# EAGLE board smoothieboard (EAGLE 6.2), part 1 of 3
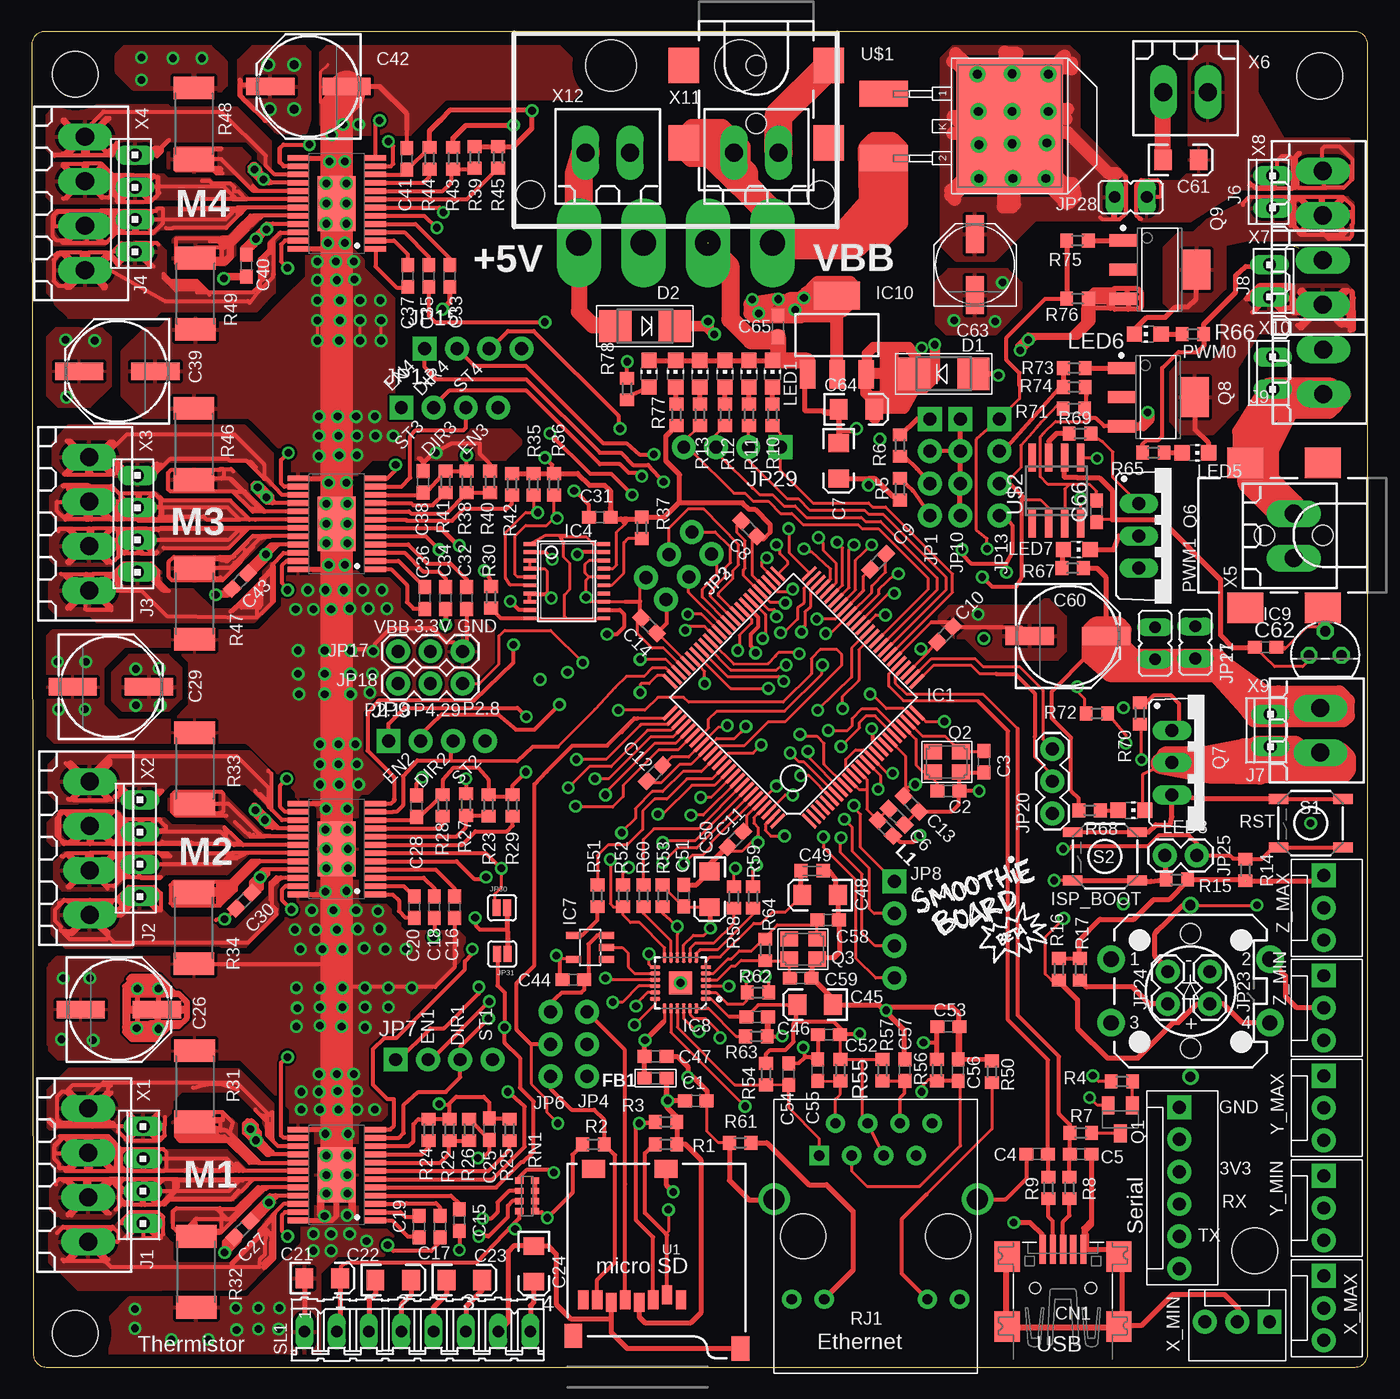
[diagram p3: board, top side]
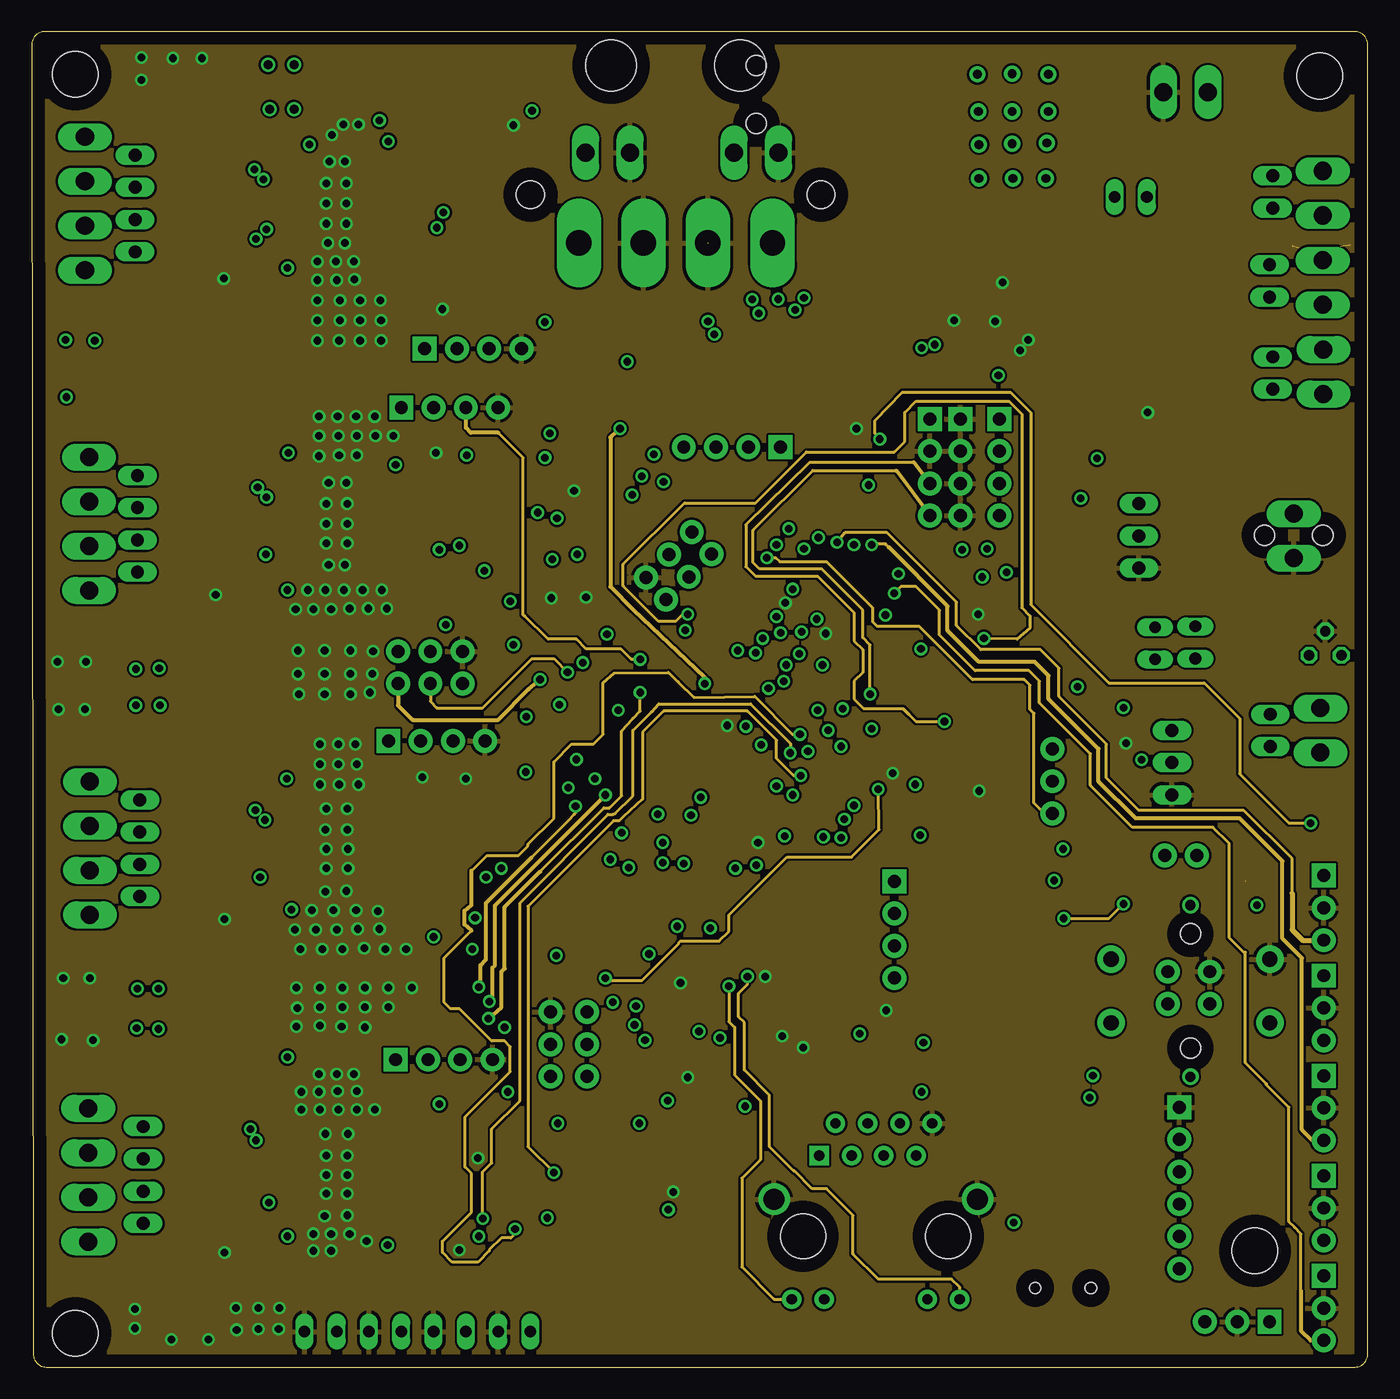
[diagram p4: board, inner layer Route2]
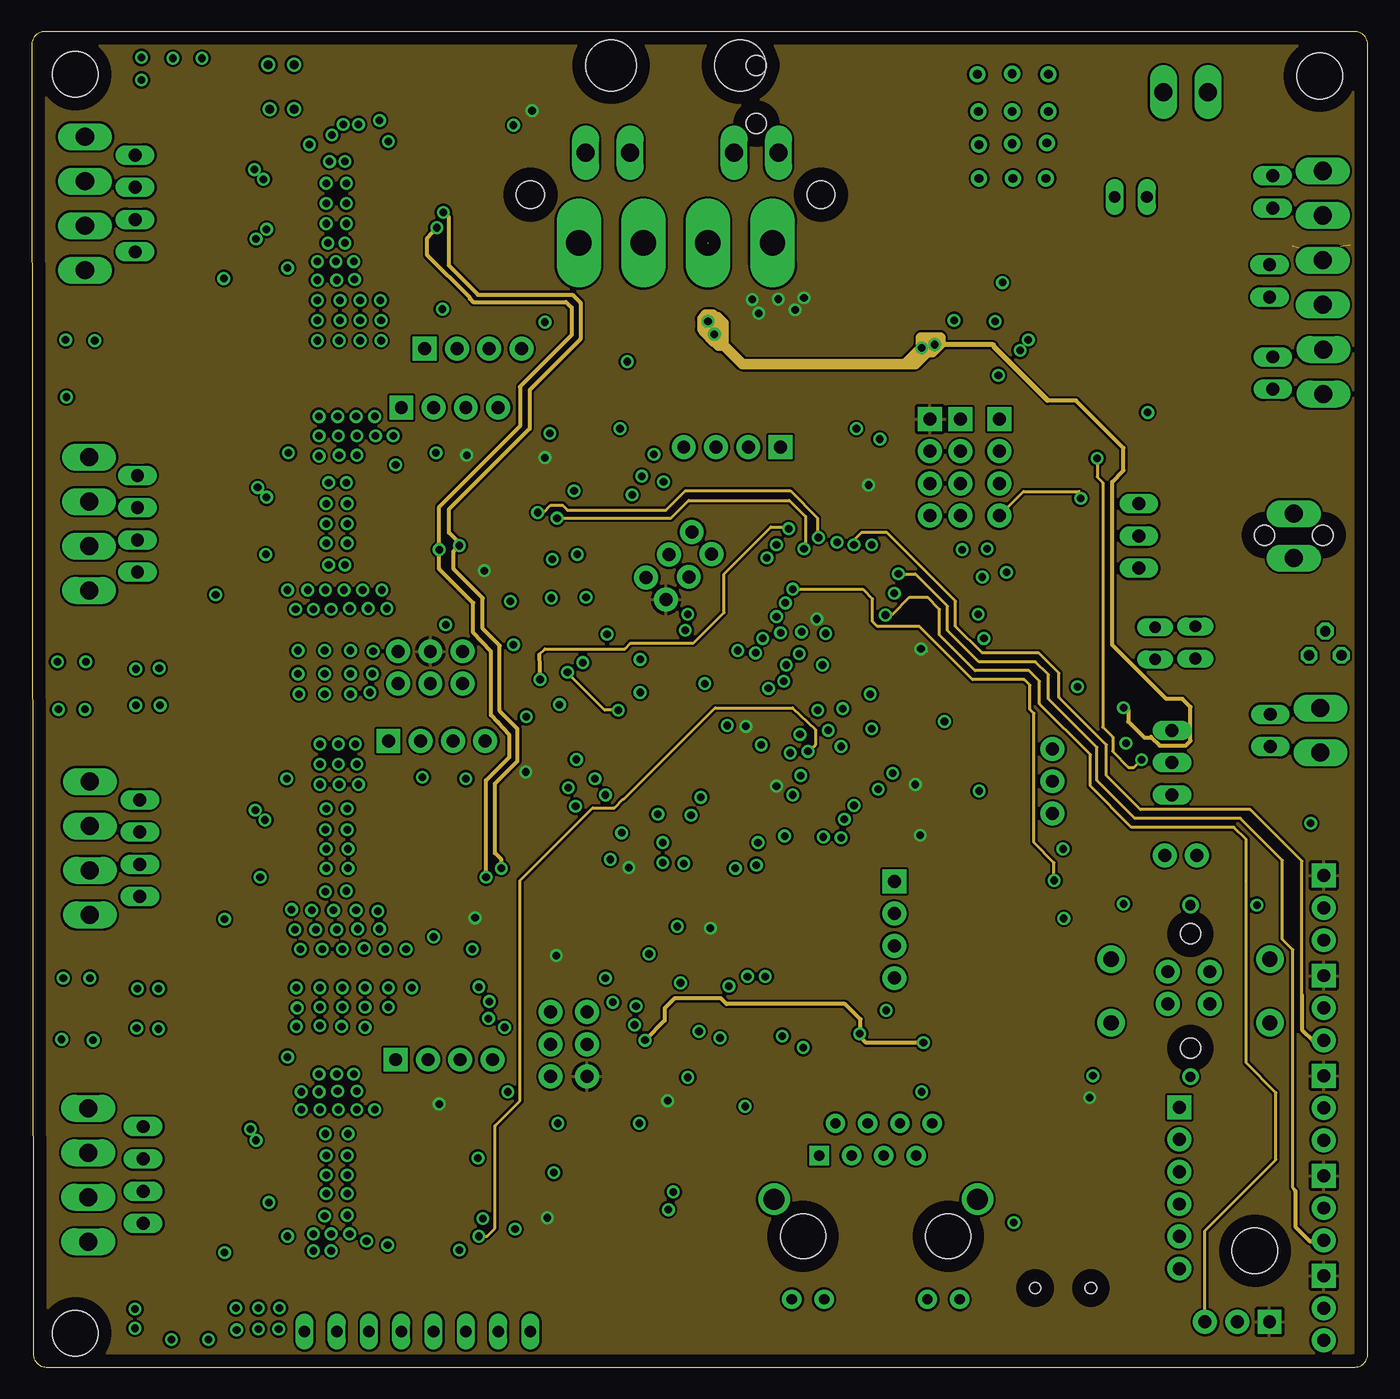
[diagram p5: board, inner layer Route15]
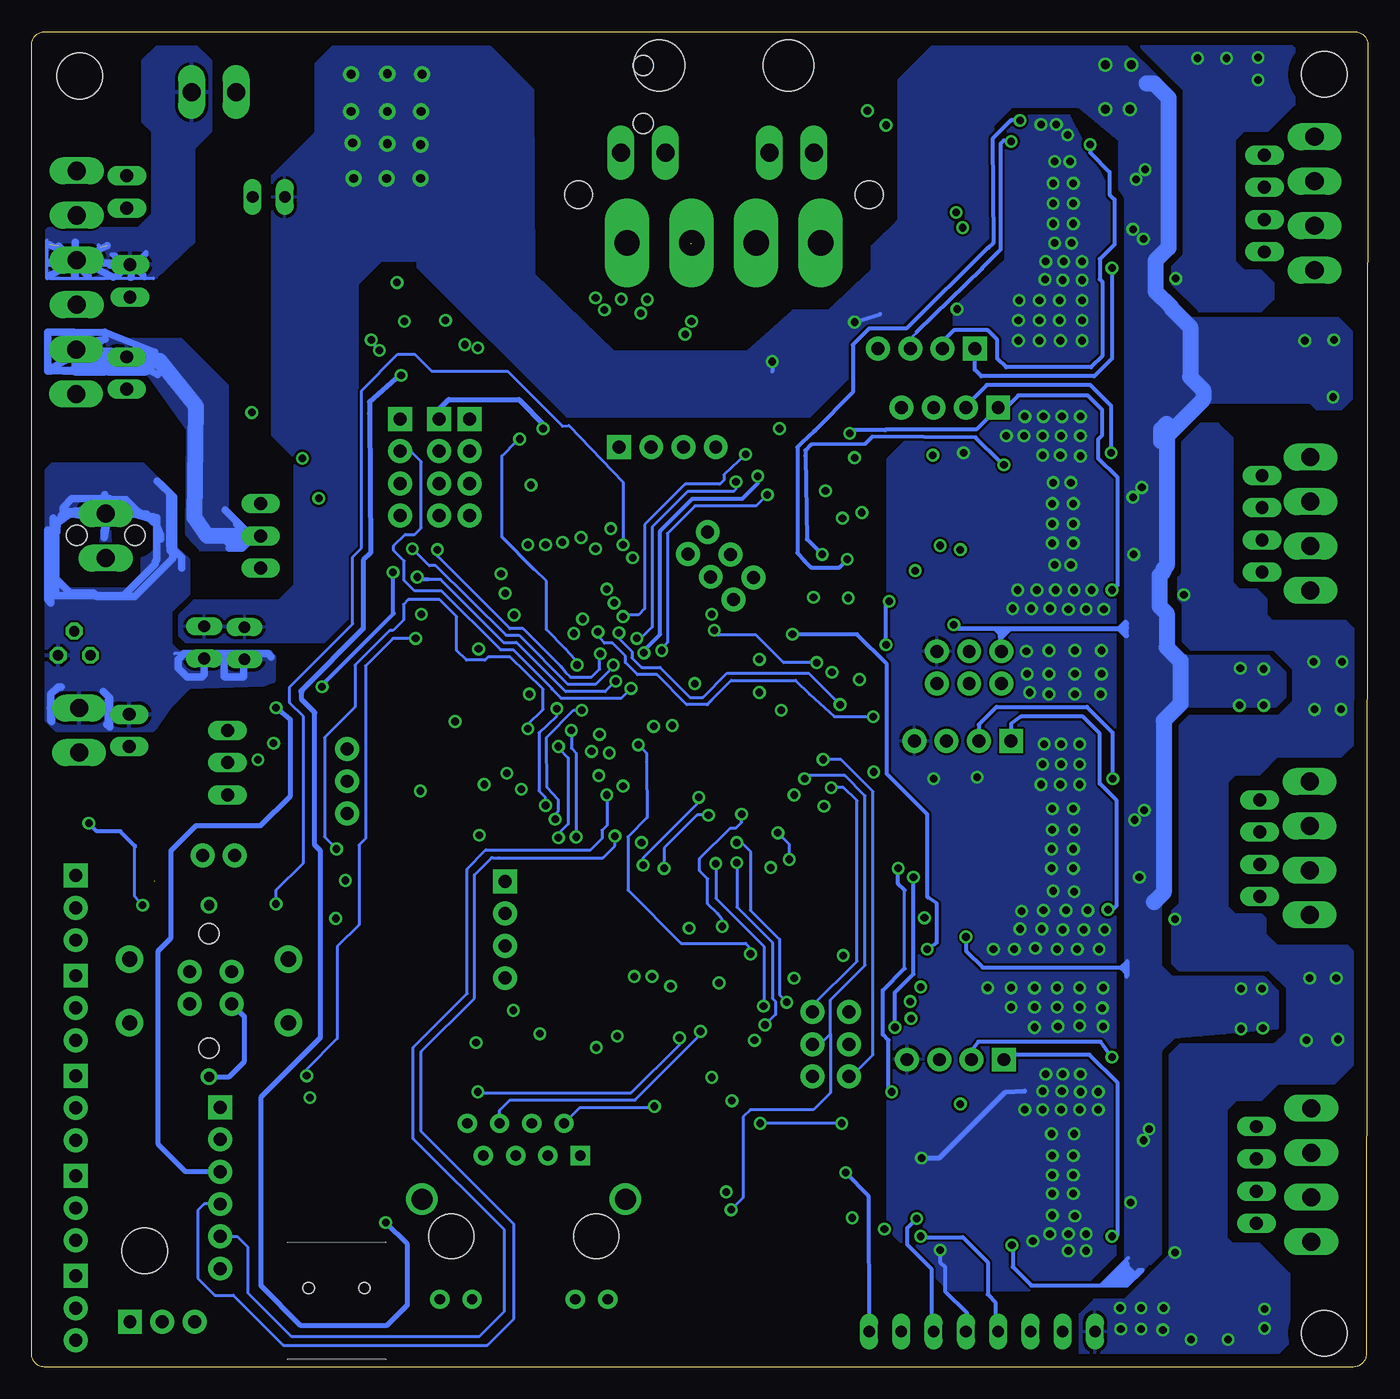
[diagram p6: board, bottom side, seen from below]

Size 105.13 x 105.08 mm. Coordinates in mm from the lower left corner, seen from the top.
Outline: 0,104.08 0.12,1 arc90 1.12,0 104.13,0 arc90 105.13,1 105.13,104.08 arc90 104.13,105.08 1,105.08 arc90 0,104.08
Copper layers (1*2+15*16): Top 0.035mm / dielectric 0.5mm / Route2 0.035mm / dielectric 0.5mm / Route15 0.035mm / dielectric 0.5mm / Bottom 0.035mm
Design rules: minimum track width 10mil, minimum drill 12mil, track to track 7mil, track to pad 7mil, pad to pad 7mil, via to via 7mil, smd to smd 7mil, copper to edge 40mil, drill to drill 8mil, minimum pad ring 10mil, minimum via ring 8mil, stop-mask expansion 4mil, vias tented up to drill 0mil, thermal gap 10mil
Holes 3.6 mm at 3.43,101.73 3.43,2.67 96.26,9.14 101.34,101.6

## Footprints (pad centres in the part's own frame; a part is rotated, then mirrored left to right if it is on the bottom)
C0603 = smd 1.1 x 1: 1 -0.85,0; 2 0.85,0
EIA3216 = smd 1.4 x 1.6: A 1.4,0; C -1.4,0
PANASONIC_E = smd 3.8 x 1.4: + 3,0; - -3,0
C0603K = smd 1.05 x 1.08: 1 -0.875,0; 2 0.875,0
PANASONIC_D = smd 3 x 1.4: + 2.4,0; - -2.4,0
USB-MINIB = smd 0.5 x 2.308: D+ 0,4.064; D- -0.8,4.064; GND 1.6,4.064; ID 0.8,4.064; VBUS -1.6,4.064 | smd 2 x 2.4: GND1 -4.4,-2; GND2 -4.4,3.5; GND3 4.4,3.5; GND4 4.4,-2 | hole 0.9: -2.2,1; 2.2,1
SMADIODE = smd 2.54 x 2.54: A 2.349,0; C -2.349,0
0603 = smd 1.1 x 1: 1 -0.85,0; 2 0.85,0
LQFP100 = smd 0.27 x 1.5: 1 -6,-7.75; 2 -5.5,-7.75; 3 -5,-7.75; 4 -4.5,-7.75; 5 -4,-7.75; 6 -3.5,-7.75; 7 -3,-7.75; 8 -2.5,-7.75; 9 -2,-7.75; 10 -1.5,-7.75; 11 -1,-7.75; 12 -0.5,-7.75; 13 0,-7.75; 14 0.5,-7.75; 15 1,-7.75; 16 1.5,-7.75; 17 2,-7.75; 18 2.5,-7.75; 19 3,-7.75; 20 3.5,-7.75; 21 4,-7.75; 22 4.5,-7.75; 23 5,-7.75; 24 5.5,-7.75; 25 6,-7.75; 51 6,7.75; 52 5.5,7.75; 53 5,7.75; 54 4.5,7.75; 55 4,7.75; 56 3.5,7.75; 57 3,7.75; 58 2.5,7.75; 59 2,7.75; 60 1.5,7.75; 61 1,7.75; 62 0.5,7.75; 63 0,7.75; 64 -0.5,7.75; 65 -1,7.75; 66 -1.5,7.75; 67 -2,7.75; 68 -2.5,7.75; 69 -3,7.75; 70 -3.5,7.75; 71 -4,7.75; 72 -4.5,7.75; 73 -5,7.75; 74 -5.5,7.75; 75 -6,7.75 | smd 1.5 x 0.27: 26 7.75,-6; 27 7.75,-5.5; 28 7.75,-5; 29 7.75,-4.5; 30 7.75,-4; 31 7.75,-3.5; 32 7.75,-3; 33 7.75,-2.5; 34 7.75,-2; 35 7.75,-1.5; 36 7.75,-1; 37 7.75,-0.5; 38 7.75,0; 39 7.75,0.5; 40 7.75,1; 41 7.75,1.5; 42 7.75,2; 43 7.75,2.5; 44 7.75,3; 45 7.75,3.5; 46 7.75,4; 47 7.75,4.5; 48 7.75,5; 49 7.75,5.5; 50 7.75,6; 76 -7.75,6; 77 -7.75,5.5; 78 -7.75,5; 79 -7.75,4.5; 80 -7.75,4; 81 -7.75,3.5; 82 -7.75,3; 83 -7.75,2.5; 84 -7.75,2; 85 -7.75,1.5; 86 -7.75,1; 87 -7.75,0.5; 88 -7.75,0; 89 -7.75,-0.5; 90 -7.75,-1; 91 -7.75,-1.5; 92 -7.75,-2; 93 -7.75,-2.5; 94 -7.75,-3; 95 -7.75,-3.5; 96 -7.75,-4; 97 -7.75,-4.5; 98 -7.75,-5; 99 -7.75,-5.5; 100 -7.75,-6
ETSSOP24 = smd 4.32 x 3: EPAD 0,0 | smd 0.45 x 1.65: P01 -3.575,-3.05; P02 -2.925,-3.05; P03 -2.275,-3.05; P04 -1.625,-3.05; P05 -0.975,-3.05; P06 -0.325,-3.05; P07 0.325,-3.05; P08 0.975,-3.05; P09 1.625,-3.05; P10 2.275,-3.05; P11 2.925,-3.05; P12 3.575,-3.05; P13 3.575,3.05; P14 2.925,3.05; P15 2.275,3.05; P16 1.625,3.05; P17 0.975,3.05; P18 0.325,3.05; P19 -0.325,3.05; P20 -0.975,3.05; P21 -1.625,3.05; P22 -2.275,3.05; P23 -2.925,3.05; P24 -3.575,3.05
TSSOP20 = smd 0.305 x 0.991: 1 -2.925,-2.918; 2 -2.275,-2.918; 3 -1.625,-2.918; 4 -0.975,-2.918; 5 -0.325,-2.918; 6 0.325,-2.918; 7 0.975,-2.918; 8 1.625,-2.918; 9 2.275,-2.918; 10 2.925,-2.918; 11 2.925,2.918; 12 2.275,2.918; 13 1.625,2.918; 14 0.975,2.918; 15 0.325,2.918; 16 -0.325,2.918; 17 -0.975,2.918; 18 -1.625,2.918; 19 -2.275,2.918; 20 -2.925,2.918
SOT23-5 = smd 0.55 x 1.2: 1 -0.95,-1.3; 2 0,-1.3; 3 0.95,-1.3; 4 0.95,1.3; 5 -0.95,1.3
QFN24_4MM = smd 0.8 x 0.28: 1 -2,1.25; 2 -2,0.75; 3 -2,0.25; 4 -2,-0.25; 5 -2,-0.75; 6 -2,-1.25; 13 2,-1.25; 14 2,-0.75; 15 2,-0.25; 16 2,0.25; 17 2,0.75; 18 2,1.25 | smd 0.28 x 0.8: 7 -1.25,-2; 8 -0.75,-2; 9 -0.25,-2; 10 0.25,-2; 11 0.75,-2; 12 1.25,-2; 19 1.25,2; 20 0.75,2; 21 0.25,2; 22 -0.25,2; 23 -0.75,2; 24 -1.25,2 | smd 1.778 x 1.778: THERM 0,0
TO92 = drill 0.813 octagon: 1 -1.27,0; 2 0,1.905; 3 1.27,0
SOT223 = smd 1.219 x 2.235: 1 -2.311,-3.099; 2 0,-3.099; 3 2.311,-3.099 | smd 3.6 x 2.2: 4 0,3.099
10X04MTA = drill 1.016 long: 1 3.81,0; 2 1.27,0; 3 -1.27,0; 4 -3.81,0
POWER_JACK_SMD = smd 2.8 x 2.4: GND 0,-5.7; P$4 6.1,-5.7; VIN0 0,5.7; VIN1 6.1,5.7 | hole 1.6: 0,0; 4.572,0
10X02MTA = drill 1.016 long: 1 1.27,0; 2 -1.27,0
1X04_NO_SILK = drill 1.016 pad 1.88 square: 1 0,0 | drill 1.016 pad 1.88: 2 2.54,0; 3 5.08,0; 4 7.62,0
1X03_NO_SILK = drill 1.016 pad 1.88: 1 0,0; 2 2.54,0; 3 5.08,0
MOLEX-1X6 = drill 1.016 pad 1.88 square: 1 0,0 | drill 1.016 pad 1.88: 2 2.54,0; 3 5.08,0; 4 7.62,0; 5 10.16,0; 6 12.7,0
JP1 = drill 0.914 long: 1 0,-1.27; 2 0,1.27
MOLEX-1X3 = drill 1.016 pad 1.88 square: 1 0,0 | drill 1.016 pad 1.88: 2 2.54,0; 3 5.08,0
1X03 = drill 1.016 pad 1.88: 1 0,0; 2 2.54,0; 3 5.08,0
1X02 = drill 1.016 pad 1.88: 1 0,0; 2 2.54,0
SJ_2S = smd 0.635 x 1.27: 1 -0.412,0; 2 0.412,0
CHIP-LED0805 = smd 1.2 x 1.2: A 0,-1.05; C 0,1.05
MOLEX8981 = drill 2 pad 3.5 long: P$1 -1.27,2.54; P$2 -1.27,7.62; P$3 -1.27,12.7; P$4 -1.27,17.78 | hole 2.2: 2.54,21.59; 2.54,-1.27 | hole 4: 12.7,5.08; 12.7,15.24
SOT23-BEC = smd 1 x 1.4: B -0.95,-1.1; C 0,1.1; E 0.95,-1.1
CRYSTAL_3.2X2.5 = smd 1.4 x 1.2: 1 -1.1,-0.8; 2 1.1,0.8; GND1 -1.1,0.8; GND2 1.1,-0.8
TO220BV = drill 1.016 long: D 0,-2.54; G -2.54,-2.54; S 2.54,-2.54
SOT230P700X160-4N = smd 2.15 x 0.95: 1 -2.9,2.3; 2 -2.9,0; 3 -2.9,-2.3 | smd 2.15 x 3.15: 4 2.9,0
R0603 = smd 1 x 1.1: 1 -0.85,0; 2 0.85,0
R2512 = smd 1.8 x 3.2: 1 -2.8,0; 2 2.8,0
HR911105A = drill 0.813 pad 1.524: G+ 4.953,-6.604; G- 4.953,-4.064; GND -8.89,4.445; NC -6.35,3.175; P4 -8.89,-0.635; P5 -6.35,0.635; RD+ -6.35,-1.905; RD- -8.89,1.905; TD- -8.89,-3.175; Y+ 4.953,6.604; Y- 4.953,4.064 | drill 1.651 pad 2.159: SHIELD0 -2.921,8.001; SHIELD1 -2.921,-8.001 | drill 0.813 pad 1.524 square: TD+ -6.35,-4.445 | hole 3.556: 0,-5.715; 0,5.715
0603-ARV = smd 0.5 x 0.65: 1 -1.2,-0.625; 2 -0.4,-0.625; 3 0.4,-0.625; 4 1.2,-0.625; 5 1.2,0.625; 6 0.4,0.625; 7 -0.4,0.625; 8 -1.2,0.625
TACTILE_SWITCH_SMD = smd 1.524 x 0.762: 1 -2.54,1.905; 2 2.54,1.905; 3 -2.54,-1.905; 4 2.54,-1.905
TACTILE-PTH-LED-12MM = drill 1.2 pad 2.159: 1 -6.25,2.5; 2 6.25,2.5; 3 -6.25,-2.5; 4 6.25,-2.5 | drill 0.8: A 0,6.75; C 0,-6.75 | hole 1.6: 0,4.5; 0,-4.5
08P = drill 0.914 long: 1 -8.89,0; 2 -6.35,0; 3 -3.81,0; 4 -1.27,0; 5 1.27,0; 6 3.81,0; 7 6.35,0; 8 8.89,0
MICRO-SD-SOCKET-PP = smd 0.8 x 1.5: 1 -8.94,10.7; 2 -7.84,10.3; 3 -6.74,10.7; 4 -5.64,10.9; 5 -4.54,10.7; 6 -3.44,10.9; 7 -2.34,10.7; 8 -1.24,10.7 | smd 1.8 x 1.4: CD1 -2.05,0.4; CD2 -7.75,0.4 | smd 1.4 x 1.9: GND1 -13.6,14.55; GND3 -0.45,13.55
TO263AB = smd 2.032 x 3.81: 1 3.81,2.54; 2 8.89,2.54 | smd 10.668 x 8.382: K 6.35,12.446
SOIC8 = smd 0.6 x 2.2: 1 -1.905,-2.6; 2 -0.635,-2.6; 3 0.635,-2.6; 4 1.905,-2.6; 5 1.905,2.6; 6 0.635,2.6; 7 -0.635,2.6; 8 -1.905,2.6
180G-4 = drill 1.422 long: 1 -5.25,0; 2 -1.75,0; 3 1.75,0; 4 5.25,0
180G-2 = drill 1.422 long: 1 -1.75,0; 2 1.75,0

## Placement (x,y rotation side)
C1  .1uF  [C0603]  52.26,20.95 180 top
C2  12pF  [C0603]  72.13,45.34 0 top
C3  12pF  [C0603]  74.93,47.62 270 top
C4  18pF  [C0603]  79.12,16.76 0 top
C5  18pF  [C0603]  82.55,16.76 180 top
C6  .1uF  [C0603]  68.07,43.31 315 top
C7  10uF  [EIA3216]  63.5,71.31 270 top
C8  .1uF  [C0603]  56.45,65.98 315 top
C9  .1uF  [C0603]  66.61,63.37 225 top
C10  .1uF  [C0603]  71.88,57.66 225 top
C11  .1uF  [C0603]  55.37,41.53 45 top
C12  .1uF  [C0603]  49.02,46.74 225 top
C13  .1uF  [C0603]  69.21,44.32 135 top
C14  .1uF  [C0603]  48.58,58.36 315 top
C15  .22uF  [C0603]  33.65,11.56 90 top
C16  .22uF  [C0603]  33.27,36.2 90 top
C17  .1uF  [C0603]  32.13,11.05 90 top
C18  .1uF  [C0603]  31.69,36.2 90 top
C19  .1uF  [C0603]  30.48,11.05 270 top
C20  .1uF  [C0603]  30.1,36.2 270 top
C21  10uF  [EIA3216]  22.86,6.99 0 top
C22  10uF  [EIA3216]  28.45,6.86 0 top
C23  10uF  [EIA3216]  34.03,6.86 0 top
C24  10uF  [EIA3216]  39.5,8.13 270 top
C25  .1uF  [C0603]  36,18.73 270 top
C26  100uF  [PANASONIC_E]  6.86,28.13 0 top
C27  .1uF  [C0603]  16.57,10.86 225 top
C28  .1uF  [C0603]  30.29,44.13 90 top
C29  100uF  [PANASONIC_E]  6.22,53.53 0 top
C30  .1uF  [C0603]  16.7,36.7 225 top
C31  .1uF  [C0603]  44.7,66.87 0 top
C32  .22uF  [C0603]  34.23,60.52 90 top
C33  .22uF  [C0603]  32.89,85.85 90 top
C34  .1uF  [C0603]  32.57,60.52 90 top
C35  .1uF  [C0603]  31.24,85.85 90 top
C36  .1uF  [C0603]  30.92,60.52 270 top
C37  .1uF  [C0603]  29.59,85.85 270 top
C38  .1uF  [C0603]  30.8,69.66 90 top
C39  100uF  [PANASONIC_E]  6.73,78.36 180 top
C40  .1uF  [C0603]  16.89,86.68 270 top
C41  .1uF  [C0603]  29.53,95.06 90 top
C42  100uF  [PANASONIC_E]  21.78,100.77 180 top
C43  .1uF  [C0603]  16.38,61.85 225 top
C44  .1uF  [C0603]  42.61,30.48 0 top
C45  10uF  [EIA3216]  61.66,28.51 180 top
C46  .1uF  [C0603]  57.09,27.56 0 top
C47  .1uF  [C0603]  49.08,24.45 0 top
C48  1uF  [EIA3216]  62.04,37.15 180 top
C49  470pF  [C0603K]  61.4,39.05 0 top
C50  10uF  [EIA3216]  53.34,37.59 270 top
C51  .1uF  [C0603]  51.31,37.08 90 top
C52  .1uF  [C0603]  62.74,26.16 180 top
C53  .1uF  [C0603]  72.13,26.8 0 top
C54  18pF  [C0603]  59.56,23.05 90 top
C55  18pF  [C0603]  61.85,23.37 90 top
C56  18pF  [C0603]  72.9,23.37 90 top
C57  18pF  [C0603]  68.71,23.37 90 top
C58  12pF  [C0603]  62.67,35.18 0 top
C59  12pF  [C0603]  60.51,30.61 0 top
C60  100uF  [PANASONIC_E]  81.53,57.53 0 top
C61  10uF  [EIA3216]  90.42,95 0 top
C62  .1uF  [C0603]  97.09,56.64 0 top
C63  100uF  [PANASONIC_D]  74.23,86.74 90 top
C64  10uF  [EIA3216]  64.9,75.37 0 top
C65  .1uF  [C0603]  58.72,81.91 270 top
C66  .1uF  [C0603]  83.79,67.35 90 top
CN1  [USB-MINIB]  81.15,5.21 0 top
D1  MBRA210LT3  [SMADIODE]  71.75,78.17 0 top
D2  MBRA210LT3  [SMADIODE]  48.26,81.92 180 top
FB1  [0603]  49.08,22.73 180 top
IC1  [LQFP100]  59.94,52.7 45 top
IC2  A4982  [ETSSOP24]  24,15.11 90 top
IC3  A4982  [ETSSOP24]  24,40.77 90 top
IC4  MCP44X1  [TSSOP20]  42.1,61.85 270 top
IC5  A4982  [ETSSOP24]  24,66.36 90 top
IC6  A4982  [ETSSOP24]  24,91.57 90 top
IC7  [SOT23-5]  43.94,33.02 90 top
IC8  [QFN24_4MM]  51.05,30.23 180 top
IC9  78L12Z  [TO92]  101.79,56.01 0 top
IC10  LM1117-3.3V  [SOT223]  63.37,81.22 0 top
J1  [10X04MTA]  8.76,15.11 90 top
J2  [10X04MTA]  8.51,40.83 90 top
J3  [10X04MTA]  8.32,66.36 90 top
J4  [10X04MTA]  8.13,91.57 90 top
J5  POWER_JACKSMD  [POWER_JACK_SMD]  101.6,65.47 180 top
J6  [10X02MTA]  97.65,92.48 90 top
J7  [10X02MTA]  97.47,50.1 90 top
J8  [10X02MTA]  97.41,85.47 270 top
J9  [10X02MTA]  97.66,78.22 90 top
J10  POWER_JACKSMD  [POWER_JACK_SMD]  57.02,102.43 270 top
JP1  [1X04_NO_SILK]  70.67,74.61 270 top
JP2  [1X03_NO_SILK]  49.91,60.39 45 top
JP3  [1X03_NO_SILK]  51.94,65.72 225 top
JP4  [1X03_NO_SILK]  43.69,22.86 90 top
JP5  [MOLEX-1X6]  90.3,20.45 270 top
JP6  [1X03_NO_SILK]  40.83,22.86 90 top
JP7  [1X04_NO_SILK]  28.64,24.19 0 top
JP8  [1X04_NO_SILK]  67.88,38.23 270 top
JP9  [1X04_NO_SILK]  28.07,49.28 0 top
JP10  [1X04_NO_SILK]  73.09,74.61 270 top
JP11  [JP1]  91.57,57.02 0 top
JP12  [1X04_NO_SILK]  29.08,75.5 0 top
JP13  [1X04_NO_SILK]  76.14,74.61 270 top
JP14  [MOLEX-1X3]  101.66,7.18 270 top
JP15  [1X04_NO_SILK]  30.92,80.14 0 top
JP16  [MOLEX-1X3]  101.66,15.05 270 top
JP17  [1X03]  28.83,56.32 0 top
JP18  [1X03]  33.91,53.78 180 top
JP19  [MOLEX-1X3]  101.66,22.92 270 top
JP20  [1X03]  80.33,48.64 270 top
JP21  [MOLEX-1X3]  101.66,30.8 270 top
JP22  [MOLEX-1X3]  101.66,38.67 270 top
JP23  [1X02]  92.71,28.57 90 top
JP24  [1X02]  89.41,28.57 90 top
JP25  [1X02]  91.69,40.26 180 top
JP26  [MOLEX-1X3]  97.41,3.56 180 top
JP27  [JP1]  88.39,56.96 0 top
JP28  [JP1]  86.49,92.08 90 top
JP29  [1X04_NO_SILK]  58.93,72.39 180 top
JP30  [SJ_2S]  37.01,36.14 0 top
JP31  [SJ_2S]  37.02,32.5 180 top
L1  [0603]  67.18,42.42 315 top
LED1  [CHIP-LED0805]  58.29,78.17 0 top
LED2  [CHIP-LED0805]  56.45,78.17 0 top
LED3  [CHIP-LED0805]  54.55,78.17 0 top
LED4  [CHIP-LED0805]  52.58,78.17 0 top
LED5  [CHIP-LED0805]  91.57,71.95 270 top
LED6  [CHIP-LED0805]  87.82,81.28 90 top
LED7  [CHIP-LED0805]  82.23,64.33 270 top
LED8  [CHIP-LED0805]  86.55,43.81 270 top
LED9  [CHIP-LED0805]  50.67,78.17 0 top
LED10  [CHIP-LED0805]  48.58,78.17 0 top
POWER  POWER  [MOLEX8981]  60.83,89.73 90 top
Q1  BC857ALT1SMD  [SOT23-BEC]  85.66,19.49 180 top
Q2  12MHz  [CRYSTAL_3.2X2.5]  72.01,47.62 180 top
Q3  25MHz  [CRYSTAL_3.2X2.5]  60.7,32.89 0 top
Q6  IRF540  [TO220BV]  89.66,65.41 270 top
Q7  IRF540  [TO220BV]  92.26,47.56 270 top
Q8  BSP100  [SOT230P700X160-4N]  88.64,76.33 0 top
Q9  BSP100  [SOT230P700X160-4N]  88.77,86.36 0 top
R1  10K  [R0603]  49.91,17.53 0 top
R2  10K  [R0603]  44.19,17.53 180 top
R3  10K  [R0603]  49.91,19.3 0 top
R4  470R  [R0603]  85.79,22.48 180 top
R5  10K  [R0603]  68.33,69.08 270 top
R6  10K  [R0603]  68.32,72.52 90 top
R7  1.5K  [R0603]  82.55,18.41 0 top
R8  33R  [R0603]  81.66,14.1 90 top
R9  33R  [R0603]  80.01,14.1 90 top
R10  1k  [R0603]  58.29,74.93 270 top
R11  1k  [R0603]  56.45,74.93 270 top
R12  1k  [R0603]  54.55,74.93 270 top
R13  1k  [R0603]  52.58,74.93 270 top
R14  10K  [R0603]  95.5,39.12 270 top
R15  10K  [R0603]  90.11,38.35 0 top
R16  10K  [R0603]  80.83,31.31 90 top
R17  330R  [R0603]  82.49,31.31 270 top
R22  NP  [R0603]  32.89,18.67 270 top
R23  NP  [R0603]  35.94,44.2 90 top
R24  10K  [R0603]  31.24,18.67 90 top
R25  10K  [R0603]  37.59,18.67 90 top
R26  10K  [R0603]  34.42,18.67 90 top
R27  10K  [R0603]  34.16,44.26 90 top
R28  10K  [R0603]  32.32,44.2 90 top
R29  10K  [R0603]  37.84,44.2 90 top
R30  33K  [R0603]  36.13,60.58 90 top
R31  0.05R  [R2512]  12.83,22.1 270 top
R32  0.05R  [R2512]  12.95,7.49 90 top
R33  0.05R  [R2512]  12.83,47.12 270 top
R34  0.05R  [R2512]  12.76,34.54 90 top
R35  10K  [R0603]  39.5,69.47 90 top
R36  10K  [R0603]  41.08,69.47 90 top
R37  100K  [R0603]  48,66.04 90 top
R38  NP  [R0603]  34.23,69.66 90 top
R39  NP  [R0603]  34.86,95.19 90 top
R40  10K  [R0603]  36.07,69.66 90 top
R41  10K  [R0603]  32.57,69.66 90 top
R42  10K  [R0603]  37.78,69.47 90 top
R43  10K  [R0603]  33.15,95.12 90 top
R44  10K  [R0603]  31.3,95.12 90 top
R45  10K  [R0603]  36.7,95.19 90 top
R46  0.05R  [R2512]  12.76,72.64 270 top
R47  0.05R  [R2512]  12.83,60.07 90 top
R48  0.05R  [R2512]  12.76,97.85 270 top
R49  0.05R  [R2512]  12.89,84.45 90 top
R50  330R  [R0603]  75.56,23.24 270 top
R51  22R  [R0603]  44.51,37.08 90 top
R52  1.5K  [R0603]  46.54,37.08 90 top
R53  10K  [R0603]  49.66,37.08 90 top
R54  49.9R  [R0603]  57.78,23.05 270 top
R55  49.9R  [R0603]  63.63,23.37 270 top
R56  49.9R  [R0603]  71.25,23.37 270 top
R57  49.9R  [R0603]  66.93,23.37 270 top
R58  22R  [R0603]  55.24,36.96 90 top
R59  22R  [R0603]  56.77,36.96 90 top
R60  22R  [R0603]  48.13,37.08 90 top
R61  330R  [R0603]  55.75,17.65 0 top
R62  10K  [R0603]  57.15,29.46 180 top
R63  12.1K  [R0603]  57.02,26.04 180 top
R64  1M  [R0603]  57.72,32.83 270 top
R65  5.6K  [R0603]  88.26,71.95 0 top
R66  5.6K  [R0603]  91.38,81.28 180 top
R67  5.6K  [R0603]  81.91,62.87 180 top
R68  5.6K  [R0603]  83.25,43.81 0 top
R69  22R  [R0603]  82.5,73.46 0 top
R70  22R  [R0603]  87.18,51.44 90 top
R71  10k  [R0603]  82.01,75.43 180 top
R72  10k  [R0603]  83.82,51.44 180 top
R73  22R  [R0603]  82.04,78.61 180 top
R74  10k  [R0603]  82.04,77.13 0 top
R75  22R  [R0603]  82.29,88.65 180 top
R76  10k  [R0603]  82.29,84.07 0 top
R77  1k  [R0603]  50.74,74.93 270 top
R78  2.2K  [R0603]  46.86,76.96 90 top
RJ1  HR911105A  [HR911105A]  66.42,10.29 270 top
RN1  4.7K  [0603-ARV]  38.99,13.46 90 top
S1  [TACTILE_SWITCH_SMD]  100.65,42.8 180 top
S2  [TACTILE_SWITCH_SMD]  84.45,40.2 180 top
S3  SWITCH-MOMENTARY-LEDPTH  [TACTILE-PTH-LED-12MM]  91.18,29.59 0 top
SL1  [08P]  30.35,2.79 0 top
U1  USD-SOCKETNEW  [MICRO-SD-SOCKET-PP]  42.16,16 180 top
U$1  [TO263AB]  64.51,104.01 270 top
U$2  TC4427  [SOIC8]  80.64,68.96 0 top
X1  [180G-4]  4.44,15.11 270 top
X2  [180G-4]  4.57,40.83 270 top
X3  [180G-4]  4.51,66.36 270 top
X4  [180G-4]  4.19,91.57 270 top
X5  [180G-2]  99.31,65.41 270 top
X6  [180G-2]  90.8,100.33 180 top
X7  [180G-2]  101.6,85.34 270 top
X8  [180G-2]  101.6,92.38 270 top
X9  [180G-2]  101.41,50.1 270 top
X10  [180G-2]  101.65,78.33 270 top
X11  [180G-2]  57.02,95.57 0 top
X12  [180G-2]  45.34,95.57 0 top

## Tracks (layer width: path | path; a pad name or v marks a point on that pad's centre or on a via)
3.3V  (via drill 0.6)  (1 unrouted)
  Top 0.254: 51.3,36.13 51.43,36.26 51.43,36.2 51.56,36.2 | 51.56,36.2 C50.A 53.4,36.26 | IC1.71 49.21,57.78 C14.2 | IC1.42 64.01,59.63 65.47,61.15 | IC1.54 57.63,61.37 56.7,62.29 56.7,65.02 56.89,65.22 56.96,65.28 C8.2 | 56.26,42.48 56.26,43.37 IC1.96 v58.61,45.72 | IC8.9 51.3,33.21 52.07,33.97 52.89,33.97 53.4,34.48 v53.4,34.54 | 51.56,36.2 51.55,36.21 C51.1 51.29,36.21 49.66,37.85 R53.2 | 46.67,66.48 46.67,66.36 46.04,65.72 46.04,63.12 45.74,62.82 IC4.17 | 45.68,66.74 C31.2 45.53,66.86 | C12.2 48.58,45.97 49.53,45.97 50.99,47.43 51.88,47.43 53.05,48.6 IC1.84 53.05,48.67 53.91,49.47 55.31,49.47 55.82,49.97 v56.2,50.42 | R52.2 46.54,38.86 v46.99,39.31 | 42.6,32.11 41.55,32.11 v41.27,32.38 | IC1.19 67.54,49.3 68.77,48.07 68.77,45.59 | 68.77,45.59 68.77,45.21 68.58,45.02 | 65.47,61.15 65.47,61.09 64.01,59.63 64.01,59.56 63.24,58.86 v61.78,58.86 | 65.47,61.15 65.47,62.23 C9.2 66.04,62.8 | 70.67,56.45 71.25,57.09 | 70.67,56.45 C10.2 | IC1.28 68.96,54.67 70.55,56.26 | 70.36,56.2 70.36,56.52 v69.98,56.52 70.1,56.64 70.48,56.26 70.55,56.26 | 70.55,56.26 70.55,56.33 70.67,56.45 | C13.2 69.02,45.34 68.77,45.59 | 68.77,45.59 v69.53,45.85 | Q1.E 83.86,20.59 v83.25,21.21 | RN1.1 39.74,12.26 39.81,12.19 | R17.1 82.23,32.16 | 30.35,43.12 30.35,43.22 C28.1 | 32.38,45.02 32.34,45.02 R28.2 | R29.2 37.84,45.02 | C7.A | R5.2 68.29,68.43 68.26,68.45 | 29.53,94.17 C41.1 | 61.66,84.45 61.53,84.45 | 61.53,84.45 61.53,84.2 | JP31.1 37.46,32.53 37.46,34.4 | 61.53,84.9 61.53,84.45
  Top 0.305: IC6.P10 29.2,93.84 29.53,94.17 | C41.1 29.54,94.21 R44.2 | IC5.P10 30.78,68.63 C38.1 30.87,68.62 R41.2 R38.2 v34.22,71.75 | IC3.P10 30.28,43.04 30.22,43.12 30.35,43.12 32.19,44.96 32.32,44.96 32.38,45.02 32.38,46.23 33.21,47.18 35.11,47.18 35.94,46.23 R23.2 35.94,44.9 37.72,44.9 37.84,45.02 | IC2.P10 29.64,17.39 30.03,17.78 30.03,19.11 30.42,19.49 31.22,19.49 R24.2 R22.1 32.89,20.77 | 32.89,20.77 33.4,21.27 35.56,21.27 36,20.83 C25.1 37.53,19.58 R25.2 | R6.2 67.98,73.37 68.07,73.53 | C11.2 55.97,42.19 56.26,42.48 | 42.6,32.11 IC7.5 | v32.07,20.7 32.76,20.64 32.89,20.77 | RN1.4 RN1.3 | RN1.3 39.62,13.84 RN1.1 39.69,12.19 39.81,12.19 40.13,12.19 v40.58,11.75 42.54,13.72 42.54,16.7 43.34,17.5 R2.2 | RN1.2 RN1.3 | 49.21,57.78 49.97,58.55 49.97,60.33 JP2.1 | R29.2 37.84,45.78 v38.89,46.82 | C8.2 57.56,65.12 58.1,65.66 58.1,66.29 | 46.67,66.42 46.67,66.36 46.35,66.67 46.35,66.74 46.42,66.67 46.93,66.67 46.67,66.42 | 46.67,66.42 46.67,66.61 46.8,66.74 48.13,66.74 48.26,66.86 49.72,66.86 | R16.2 82.23,32.16 82.32,32.16 82.36,32.19 82.42,32.19 82.48,32.13 82.74,32.13 | R42.2 39.66,70.32 39.69,70.29 40.89,70.29 40.96,70.36 40.96,70.99 v40.38,71.56 | R30.2 36.13,61.85 v35.62,62.67 | 41.55,32.11 41.55,30.66 C44.1 | L1.2 67.85,41.82 68.32,41.34 69.4,41.34 v69.91,41.85 | 37.46,32.53 37.44,32.56 37.44,34.31 37.34,34.41 35.28,34.41 34.98,34.71 v34.89,35.35
  Top 0.406: v53.4,34.54 53.4,36.26 | R6.2 68.41,73.37 69.66,74.61 JP1.1 | 68.26,68.45 68.2,68.52 67.75,68.52 66.36,69.91 65.85,69.91 | 50.1,20.95 49.97,20.83 49.97,20.45 50.76,19.66 R3.2 R1.2 51.43,17.53 52.7,16.26 52.7,4.32 51.88,3.49 48.26,3.49 47.8,3.95 U1.4 | R42.2 R35.2 R36.2 42.96,70.32 43.88,69.41 45.08,69.41 45.53,68.96 45.53,67.44 45.59,67.37 45.59,66.93 45.53,66.86 | 45.68,66.74 46.35,66.74 46.67,66.74 | 46.67,66.74 46.8,66.74 47.85,66.74 R37.2 49.81,66.89 50.99,68.07 | 46.67,66.48 46.67,66.74 | C1.2 50.1,20.95 | 50.1,20.95 49.97,21.08 FB1.1 49.91,20.95 v50.04,20.95 | 45.53,67.63 45.53,66.89 C31.2 | 58.1,65.72 58.1,66.29 56.89,67.5 56.45,67.5 55.94,68.01 51.05,68.01 50.99,68.07 | R44.2 31.3,97.28 32.13,98.11 32.19,98.11 32.19,98.17 32.96,98.93 39.18,98.93 v39.37,98.87 39.37,97.47 37.93,96.04 R39.2 R45.2 | 82.74,32.13 82.42,32.13 82.42,33.59 84.07,35.24 86.74,35.24 88.26,36.77 89.47,36.77 90.95,38.25 R15.2 95.38,38.35 95.5,38.23 95.57,38.23 | C7.A 65.85,69.91 | 65.85,69.91 v65.85,69.41 | R14.2 101.26,38.27 JP22.1 | 50.99,68.07 50.99,70.23 49.91,71.31 49.91,73.25 R77.2 | JP30.2 JP31.1
  Top 1.016: IC10.2 IC10.4 | IC10.4 63.37,84.39 63.5,84.52 63.5,84.45 63.24,84.2 63.24,84.64 62.48,85.34 | C65.1 58.74,83 59.43,83.69 60.26,83.69 | 60.26,83.69 62.75,83.69 IC10.4 | 62.48,85.34 62.29,85.28 61.53,84.9 60.96,84.52 60.58,84.14 60.51,84.14 60.45,84.07 59.62,84.07 59.24,83.69 v58.74,84.04 | v58.74,84.04 56.58,83.69 56.51,83.63 56.51,82.93 56.64,83.12 56.64,82.8 56.77,82.68 57.72,82.68 57.72,82.87 57.85,83 60.96,83 | 60.96,83 61.53,83.57 61.72,83.25 62.1,83.12 v60.77,84.14 | v58.74,84.04 60.26,83.69 | 60.26,83.69 v60.07,83.19 | 57.66,82.68 60.64,82.68 60.7,82.74 | 60.7,82.74 60.96,83 | 60.7,82.74 62.86,82.74 63.24,83.12 63.82,83.12 64.58,83.88 64.58,85.15 64.39,85.34 62.48,85.34 | 62.48,85.34 61.85,85.34 60.83,84.33
  Route15 0.254: v46.99,39.31 46.99,39.43 | v41.27,32.38 41.27,32.45 | v58.61,45.72 58.61,45.78 | v61.78,58.86 61.72,58.8 | v69.98,56.52 70.42,56.33 | v83.25,21.21 83.25,21.27
  Route15 0.305: v38.89,46.82 38.86,46.8 | v40.38,71.56 40.38,71.63 | v35.62,62.67 35.5,62.55 | v69.91,41.85 69.98,41.85 | v34.89,35.35 34.99,35.36 34.99,35.4
  Route15 0.406: v39.37,98.87 39.3,98.87
  other vias: 56.7,84.01 57.21,82.93
  pour Route15: -2.16,108.78 108.84,108.78 109.35,108.27 109.35,-2.48 107.69,-4.13 -1.02,-4.13 -2.16,-2.98
5V  (via drill 0.6)
  Top 0.254: IC10.3 65.68,78.14 65.59,78.23 65.59,78.17 | 53.28,81.85 53.28,81.92
  Top 0.406: 66.93,76.52 66.93,80.01 67.12,80.01 67.37,79.76 67.37,76.83 67.31,76.83 67.25,76.9 67.25,79.63 67.18,79.69
  Top 0.813: D1.C 66.17,78.17 65.85,78.11 65.66,78.11 65.59,78.17 65.59,76.83 65.98,76.45 | 66.04,76.39 66.29,76.14 | 66.29,76.14 66.29,74.68 66.36,74.61 | C64.A 68.2,75.44 68.64,75.44 69.66,77.28 | 69.66,77.28 68.64,77.34 68.64,76.26 68.58,76.2 67.31,76.2 | 67.31,76.2 66.36,76.2 | 66.36,76.2 66.29,76.14 | 66.36,76.2 66.04,76.2 65.59,76.64 65.66,76.64 65.85,76.45 65.98,76.45 | 65.98,76.45 66.04,76.39 | 66.04,76.39 66.74,76.39 67.69,76.64 67.69,80.2 67.12,80.01 67.12,80.07 67.31,80.26 69.02,80.26 69.66,79.38 68.58,78.23 65.72,78.23 65.72,79.76 66.23,80.26 67.05,80.26 67.12,80.2 67.18,80.2 67.25,80.26 67.12,80.26 67.82,80.2 67.82,76.45 67.31,76.2 | D2.C 53.28,81.92 | v53.21,82.3 53.28,81.85 53.28,81.72 v53.72,81.28 | v71.06,80.45 71.06,77.85 70.17,76.96 69.98,76.96 69.66,77.28
  Route15 0.305: v85.91,51.88 86.29,51.75 86.29,50.8 87.56,49.53 88.01,49.53 88.07,49.59 88.77,48.9 90.8,48.9 91.18,49.28 91.18,51.94 90.55,52.58 89.28,52.58 85.03,56.83 85.03,69.66 85.91,70.55 85.91,72.33 82.17,76.07 79.95,76.07
  Route15 0.406: 79.95,76.07 75.75,80.26 75.75,80.33 75.63,80.45 v71.06,80.45
  Route15 0.813: v53.21,82.3 53.53,81.72 53.53,81.34 53.97,80.9 | 53.97,80.9 54.16,80.71 | 54.42,80.45 54.48,80.39 | 54.48,80.39 55.94,78.93 68.71,78.93 69.98,80.2 | 69.98,80.2 v70.04,80.2 | v70.04,80.2 70.29,80.2 v71.06,80.45 | 69.98,80.2 69.98,81.03 71.5,81.03 71.5,80.9 v71.06,80.45 | 69.98,80.2 70.04,80.14 | 70.04,80.14 70.8,80.14 70.93,80.26 | 70.93,80.26 70.8,80.26 69.4,79.5 | 70.93,80.26 70.93,80.33 v71.06,80.45 | 70.04,80.14 69.98,80.14 68.77,78.93 69.53,78.93 v71.06,80.45 | 71.25,81.03 71.31,81.03 71.5,80.83 71.5,80.52 70.86,79.88 70.36,79.88 v70.04,80.2 | 53.97,80.9 53.97,82.42 53.59,82.8 53.02,82.8 52.89,82.68 52.89,81.47 53.66,80.71 54.16,80.71 | 54.16,80.71 54.42,80.45 | 54.42,80.45 54.42,82.17 53.97,82.61 53.28,82.61 53.15,82.74 53.02,82.74 52.77,82.49 52.77,81.66 54.04,80.39 54.48,80.39
  Bottom 0.406: JP5.3 93.03,15.37 95.18,17.53 95.18,32.77 94.17,33.78 94.17,40.64 92.2,42.61 87.12,42.61 84.77,44.96 84.77,50.93 v85.91,51.88
+5V
  Top 1.27: POWER.P$4 43.05,83.06 44.13,81.98 45.85,81.98 D2.A
  Top 2.184: POWER.P$4 43.05,93.89 X12.1
DIR1  (via drill 0.6)
  Top 0.254: IC1.80 50.67,49.09 49.02,49.09 45.15,45.21 v45.15,45.02
  Top 0.305: v20.13,24.38 19.87,24.13 19.81,24.13 19.62,23.94 19.62,18.22 19.81,18.04 IC2.P14 | 31.37,24.13 v36,28.77
  Top 0.406: JP7.2 31.18,24.13 31.37,24.13 31.59,24.13 31.59,24
  Route2 0.305: v36,28.77 36.26,29.02 36.26,31.43 36.45,31.62 36.45,36.32 v45.15,45.02
  Bottom 0.305: v20.13,24.38 21.02,25.59 30.67,25.59 31.59,24.35 31.59,23.84
  Bottom 0.406: 31.59,23.84 31.18,23.84 JP7.2
DIR2  (via drill 0.6)
  Top 0.254: IC1.49 61.53,62.04 61.47,62.04 60.77,61.28 60.77,60.13 60.26,59.75 60.26,58.86 59.18,57.78 v58.93,57.78
  Top 0.305: IC3.P14 19.93,43.69 19.56,44.07 19.56,45.78 v20.06,46.29 | v41.53,52.13 39.56,50.16 38.1,50.16 36.7,51.37 32.26,51.37 30.61,49.78 JP9.2
  Bottom 0.254: v58.93,57.78 58.93,57.34 57.91,56.33 57.91,55.82 57.15,55.05 55.69,55.05 53.34,52.7 52.32,52.7 50.42,54.61 44,54.61 41.72,52.32
  Bottom 0.305: v20.06,46.29 20.06,49.91 22.1,51.94 29.21,51.94 30.61,50.55 JP9.2 | 41.72,52.32 v41.53,52.13
DIR3  (via drill 0.6)
  Top 0.305: IC5.P14 19.87,69.28 19.62,69.53 19.62,71.37 v20.19,71.94 | IC1.58 57.15,59.03 57.15,58.23 56.58,57.66 56.58,56.77 57.02,56.33 v56.96,56.2 | v48,70.1 47.75,70.36 46.99,70.36 46.29,71.06 44.7,71.06 38.92,76.83 32.83,76.83 31.62,75.63 JP12.2
  Bottom 0.305: v20.19,71.94 20.19,75.63 21.84,77.28 29.97,77.28 31.62,75.63 JP12.2 | v56.96,56.2 57.02,56.33 55.69,57.66 55.69,65.79 53.15,68.33 49.21,68.33 48,69.53 v48,70.1
DIR4  (via drill 0.6)
  Top 0.254: v58.61,59.05 58.61,59.44 58.42,59.63 57.97,59.63 IC1.56
  Top 0.305: 49.21,71.82 v48.96,71.82 47.81,71.82 46.8,72.71 44.96,72.71 38.86,78.8 34.8,78.8 JP15.2 | 19.56,95.95 19.49,95.89 19.49,94.81 19.81,94.49 IC6.P14 19.87,94.49 19.56,94.81 19.56,95.95 | 19.56,95.95 19.81,96.2 v21.84,96.2
  Bottom 0.254: v48.96,71.82 50.67,70.23 50.67,69.79 50.99,69.47 53.72,69.47 56.89,66.29 56.89,59.69 57.4,59.18 58.42,59.18 v58.61,59.05
  Bottom 0.305: 21.84,96.08 v21.84,96.2 21.84,95.57 20.32,94.04 20.32,92.27 19.94,91.89 19.94,88.33 21.08,87.19 21.08,85.6 20.89,85.41 20.89,79.57 21.78,78.68 28.45,78.68 29.15,79.38 29.15,80.83 29.91,81.6 32.57,81.6 33.46,80.71 JP15.2
EN1  (via drill 0.6)
  Top 0.254: IC1.81 50.86,48.58 49.34,48.58 46.54,45.78 46.54,44.9 45.72,44.07 42.86,44.07 v42.8,44.13
  Top 0.305: IC2.P23 19.93,12.19 19.68,11.94 19.68,10.73 v20.13,10.29 | v35.18,29.91 35.18,29.4 32.45,26.67 31.37,26.67 28.83,24.13
  Top 0.406: 28.83,24.13 28.64,24.13 JP7.1
  Route2 0.254: 39.3,40.07 42.29,43.05 42.67,43.5 42.8,43.62 v42.8,44.13
  Route2 0.305: v35.18,29.91 35.3,30.1 35.3,31.62 35.75,32.07 35.75,36.51 39.3,40.07
  Bottom 0.305: v20.13,10.29 19.81,10.29 19.68,10.41 19.68,22.35 21.91,24.57 27.88,24.57
  Bottom 0.406: 27.88,24.57 28.64,24.57 JP7.1
EN2  (via drill 0.6)
  Top 0.254: IC1.48 61.89,61.7 61.28,61.09 61.28,59.82 60.83,59.44 60.83,58.36 v60.58,57.85 | 38.92,51.24 v38.92,51.18
  Top 0.305: IC3.P23 20,37.84 19.68,37.53 19.68,36.77 v20.45,36.01 | 38.8,51.37 38.92,51.24 38.99,51.18 | v38.92,51.18 38.23,51.88 29.34,51.88 28.07,50.61 JP9.1
  Bottom 0.254: 60.51,57.85 v60.58,57.85 60.39,57.66 60.39,57.34 60.07,56.96 59.43,56.96 58.42,55.94 58.42,55.44 57.47,54.48 55.94,54.48 53.59,52.13 51.94,52.13 51.18,52.96 | 52.01,52.13 51.18,52.96 | 51.18,52.96 50.1,54.04 45.02,54.04 43.94,52.96 41.97,51.18 v38.92,51.18
  Bottom 0.305: v20.45,36.01 20.06,36.01 19.75,36.32 19.75,44.58 21.08,45.91 21.08,49.85 22.41,51.18 27.3,51.18 28.07,50.61 JP9.1
EN3  (via drill 0.6)
  Top 0.254: IC1.59 55.91,59.6 56.64,58.86 56.64,58.55 55.69,57.59 55.69,56.45 v55.56,56.39
  Top 0.305: v47.24,68.64 45.59,70.29 43.94,70.29 v40.77,73.47 | IC5.P23 20.06,63.43 19.68,63.06 19.68,61.72 v20.13,61.15
  Bottom 0.254: v47.24,68.64 48.13,67.75 52.96,67.75 55.12,65.6 55.12,57.02 55.69,56.45 v55.56,56.39
  Bottom 0.305: v20.13,61.15 19.68,61.53 19.68,69.98 21.21,71.5 21.21,73.03 20.89,73.34 20.89,75.31 22.03,76.45 27.49,76.45 28.45,75.5 JP12.1 30.8,73.79 37.91,73.79 37.97,73.72 40.51,73.72 v40.77,73.47
EN4  (via drill 0.6)
  Top 0.254: IC1.57 57.66,59.31 57.72,59.24 57.72,57.53 v57.53,57.34
  Top 0.305: IC6.P23 19.93,88.64 19.62,88.33 19.62,87 v20.13,86.49 | v49.72,69.66 48.51,70.99 47.31,70.99 46.35,71.94 44.7,71.94 38.92,77.72 31.88,77.72 30.92,78.68 JP15.1
  Bottom 0.254: v49.72,69.66 49.72,69.09 49.91,68.9 53.53,68.9 56.32,66.1 56.32,58.23 57.21,57.34 v57.53,57.34
  Bottom 0.305: v20.13,86.49 20.13,79.38 21.52,77.98 30.42,77.98 30.92,78.49 JP15.1
ENET_CRS
  Top 0.254: IC1.92 55.84,45.81 55.84,45.75 52.45,42.35 48.96,42.35 48.13,41.53 R60.2
ENET_MDC  (via drill 0.6)
  Top 0.254: IC1.87 54.12,47.58 54.12,47.64 54.8,48.32 56.77,48.32 v57.4,48.96 | IC8.13 48.79,31.48 48.58,31.69 v48.58,32.51
  Bottom 0.254: v57.4,48.96 56.77,48.32 56.77,47.62 56.7,43.24 58.23,41.72 58.23,37.53 54.04,33.34 48.96,33.34 48.58,32.96 v48.58,32.51
ENET_MDIO  (via drill 0.6)
  Top 0.254: IC8.12 49.8,33 47.81,34.99 47.12,34.99 46.54,35.56 46.54,36.13 46.61,36.2 46.61,36.32 46.54,36.26 R52.1 46.54,36.2 45.78,36.2 45.53,36.45 v45.53,39.94 | IC1.86 53.76,47.91 52.7,46.86 51.24,46.86 49.66,45.28 48.83,45.28 47.5,43.94 47.5,43.18 46.42,42.1 v46.42,42.04
  Bottom 0.254: v46.42,42.04 45.53,41.15 v45.53,39.94
ENET_REF_CLK
  Top 0.254: IC1.88 53.53,46.29 51.56,46.29 49.97,44.7 49.02,44.7 48.07,43.75 48.07,42.29 46.86,41.08 45.34,41.08 44.51,40.26 R51.2
ENET_RX_ER  (via drill 0.6)
  Top 0.254: IC8.10 50.8,34.03 50.8,34.04 50.8,34.61 | R53.1 49.66,35.69 50.23,35.18 50.8,34.61 | 50.8,34.61 v50.8,34.67 | IC1.89 53.72,45.78 51.94,45.78 49.66,43.5 v49.27,43.5
  Bottom 0.254: v50.8,34.67 50.8,35.24 51.18,35.69 51.94,36.45 51.94,38.42 52.58,39.05 52.58,40.01 50.16,42.42 49.72,42.42 49.27,42.86 v49.27,43.5
ENET_RXD0  (via drill 0.6)
  Top 0.254: IC1.91 55.52,46.13 52.83,43.43 v51.88,43.43 | R58.2 55.24,39.12 v55.37,39.24
  Bottom 0.254: v51.88,43.43 52.77,43.43 55.37,40.83 v55.37,39.24
ENET_RXD1  (via drill 0.6)
  Top 0.254: IC1.90 55.15,46.52 53.47,44.83 v52.64,44.83 | 57.02,39.88 v57.02,39.5 56.77,39.24 R59.2
  Bottom 0.254: v52.64,44.83 52.64,44.45 57.02,40.07 v57.02,39.5
ENET_TX_EN  (via drill 0.6)
  Top 0.254: IC1.93 56.23,45.44 52.2,41.4 49.78,41.4 v49.66,41.27 | IC8.16 47.75,29.98 46.48,28.7 v45.72,28.7
  Bottom 0.254: v49.66,41.27 49.27,41.27 48.58,40.58 48.58,35.94 46.29,33.66 46.29,29.27 v45.72,28.7
ENET_TXD0  (via drill 0.6)
  Top 0.254: IC1.95 53.47,41.27 53.47,40.96 52.77,40.26 51.94,40.26 v51.31,39.62 | IC8.17 48.46,29.48 48.07,29.08 47.55,28.56 v47.55,28.4
  Bottom 0.254: v51.31,39.62 51.31,36.89 47.5,33.08 47.5,28.45 v47.55,28.4 47.56,28.38
ENET_TXD1  (via drill 0.6)
  Top 0.254: IC1.94 52.32,40.83 50.8,40.83 v49.66,39.69 | IC8.18 49.05,28.54 v47.43,26.92
  Bottom 0.254: v49.66,39.69 49.66,36.2 46.86,33.4 46.86,29.02 46.61,28.77 46.61,27.75 v47.43,26.92
GND  (via drill 0.6, 0.6 pad 1.02)  (1 unrouted)
  Top 0.254: IC1.11 64.72,46.53 64.07,47.18 64.07,47.82 64.83,48.58 65.47,48.58 | IC1.15 66.11,47.93 | IC1.15 66.13,47.91 | IC1.72 51.28,55.02 49.72,56.58 48.83,56.58 47.69,57.72 47.69,58.67 C14.1 | 46.71,60.22 IC4.13 43.98,60.22 v43.62,60.58 43.62,61.93 43.87,62.17 | IC1.41 64.39,59.25 | 64.39,59.25 66.1,60.96 66.1,61.47 67.18,62.55 67.18,63.94 C9.1 | IC1.31 70.8,58.61 72.13,58.61 C10.1 | 61.34,24.26 C55.2 61.86,24.26 C52.2 | IC1.97 57.63,44.04 56.83,43.24 56.83,42.8 57.15,42.48 57.15,41.85 56.83,41.53 | 56.83,41.53 55.88,40.58 55.05,40.58 54.74,40.89 C11.1 | IC4.3 IC4.4 39.2,62.8 40.38,62.8 40.58,62.61 40.58,61.02 40.43,60.87 IC4.7 IC4.8 | IC4.16 43.87,62.17 | 43.87,62.17 43.56,62.48 43.56,63.18 43.88,63.5 44.99,63.5 IC4.18 | 56.83,41.53 v57.15,41.27 | v54.74,50.48 54.04,50.35 52.69,49.01 IC1.83 52.67,48.99 51.69,48.01 50.35,48.01 49.66,47.31 C12.1 | v59.31,60.13 58.99,60.2 58.1,60.2 IC1.55 56.01,62.29 56.01,62.74 56.13,62.87 56.13,65.02 55.5,65.66 55.5,66.23 C8.1 | C13.1 69.69,43.72 C6.2 | 65.47,48.58 67.31,46.74 v67.75,46.74 | 64.39,59.25 62.86,57.72 v62.48,57.72 | R62.1 58,30.14 v57.72,30.73 | R61.1 54.04,17.65 53.15,18.54 53.15,20.89 | 53.15,20.89 53.28,21.02 | 22.99,99.19 22.99,99.25 22.73,99.5 22.73,101.92 23.3,102.49 | 47.88,60.26 47.88,61.66 JP3.3 | v22.48,80.77 22.48,82.3 22.41,82.36 v22.48,82.36 | v24.19,80.77 24.19,82.3 v24.26,82.36 | v25.84,80.77 v25.84,82.36 | v27.49,80.77 v27.49,82.36 | C12.1 49.59,47.37 | C12.1 | 65.47,48.58 65.48,48.58 IC1.15 | 61.4,30.61 C59.2 | C46.2 57.96,27.19 57.97,27.18 | C57.2 68.72,24.24 68.77,24.19 | C1.1 53.15,20.95 53.15,20.89 | 58.29,13.21 RJ1.SHIELD1
  Top 0.254: 73.02,45.4 73.02,45.38 C2.2 | C3.2 74.93,46.8 | C27.2 15.97,9.62 15.94,9.59 | 87.82,75.31 v87.82,75.12 | X6.2 89.03,100.33 89.02,100.33 | 101.73,57.91 101.34,58.29 100.39,58.29 98.6,56.5 98.6,56.64 C62.2 | R72.1 86.1,49.74 v86.1,49.09 | 86.29,83.95 86.23,83.95 86.23,84.2 | C66.2 83.79,68.93 83.27,69.46 81.66,69.46 | 81.66,69.46 81.3,69.1 81.3,66.38 U$2.3 | 81.66,69.46 79.97,69.46 79.37,70.06 79.37,72.92 79.39,73.22 79.67,73.52 80.57,74.42 83.14,74.42 83.4,74.68
  Top 0.305: C41.2 29.53,97.41 | 30.8,71.18 30.86,71.25 | 30.86,71.25 31.49,71.88 33.08,72.71 35.24,72.71 35.24,71.88 36.07,71.06 R40.2 | R26.2 36,17.93 C25.2 36,16.95 35.5,16.45 v35.11,16.45 | C15.1 v33.65,9.21 | C16.1 33.27,31.43 31.75,29.91 25.21,29.91 23.37,31.74 23.36,31.74 | C30.2 15.43,35.43 15.2,35.37 | 15.2,35.37 14.48,35.18 | R34.1 23.36,31.74 | 23.36,31.74 23.43,31.81 | 12.83,31.68 R34.1 | R34.1 13.4,31.74 13.46,31.69 | JP6.3 40.83,28.64 41.72,29.46 43.24,29.46 43.5,29.72 43.5,30.47 C44.2 43.81,30.81 43.81,33.27 44.51,33.97 IC7.3 | 47.94,58.99 C14.1 47.84,59.09 47.84,60.22 | 46.71,60.22 47.84,60.22 | 47.84,60.22 47.88,60.26 | v34.16,46.29 R27.2 | C28.2 30.29,45.91 v30.73,46.42 | RJ1.SHIELD0 76.64,13.21 78.29,14.86 78.29,16.74 C4.1 | C5.1 83.4,11.58 82.74,10.92 82.74,9.28 CN1.GND | 57.91,25.97 57.97,26.04 57.97,27.18 57.97,27.62 57.91,27.62 57.87,27.58 R63.1 v59.05,26.04 | C52.2 61.86,24.71 61.85,24.7 61.85,24.51 61.66,24.32 61.66,24.38 60.96,24.38 60.83,24.51 | 60.83,24.51 v60.7,25.15 | C54.2 60.37,23.93 60.83,24.38 60.83,24.51 | C56.2 72.9,27.05 72.83,27.11 72.83,26.92 72.96,26.8 | IC4.8 39.18,60.77 39.24,60.83 | 39.24,60.83 39.11,60.83 | 39.24,60.83 40.58,60.83 v40.89,60.52 | C32.1 34.22,57.02 33.65,56.45 33.97,56.26 33.21,57.02 32.64,57.02 31.56,58.1 28.19,58.1 26.99,56.9 26.99,56.45 | 26.99,56.33 26.99,56.45 | 26.99,56.45 24.06,56.45 24,56.39 | 70.8,58.61 72.2,58.61 72.58,58.23 77.85,58.23 78.61,57.47 | C38.2 30.8,71.18 | 30.8,71.18 30.48,71.5 30.61,71.5 30.86,71.25 | 30.86,71.25 30.86,71.18 | 30.86,70.55 30.86,71.18 | 30.86,71.18 31.49,71.82 31.75,71.82 31.81,71.75 | C13.1 72.42,43.72 72.96,44.26 72.96,45.31 C2.2 72.98,46.44 73.34,46.8 74.93,46.8
  Top 0.305: v74.55,45.34 73.09,45.34 73.02,45.4 | S2.4 S2.3 87.37,42.1 | C31.1 43.85,67.84 43.05,68.64 v42.67,68.96 | 85.7,73.98 Q8.3 86.34,74.03 86.36,74.04 | 85.73,74.04 84.39,74.04 83.75,74.68 83.4,74.68 83.02,74.68 R71.1 82.99,74.74 82.99,76.48 R74.2 | S1.4 S1.3 | v15.18,35.24 15.2,35.24 15.2,35.37 | J5.VIN0 101.34,59.51 101.34,58.29 | 101.73,57.91 IC9.2 | JP10.2 JP1.2
  Top 0.406: IC5.P13 23.96,69.93 24,69.98 | IC5.P24 23.86,62.78 24,62.93 | IC3.P13 23.92,44.34 24,44.26 | IC3.P24 23.96,37.19 24,37.15 | IC2.P13 23.92,18.69 24,18.61 | IC2.P24 23.6,11.54 23.94,11.87 | C21.C SL1.1 | C22.C 27.05,5.78 26.54,5.27 SL1.3 | C23.C 32.63,5.71 31.62,4.7 SL1.5 | LED10.C LED9.C LED4.C LED3.C LED2.C LED1.C | C7.C 63.56,74.68 | 63.56,74.68 62.99,75.25 | 62.42,75.06 62.29,75.18 | 61.02,79.18 60.86,78.33 60.86,75.25 62.23,75.25 62.29,75.18 | C64.C 63.5,74.04 63.56,73.98 | 63.56,73.98 63.56,73.66 | 63.56,73.66 63.56,72.45 | 63.56,73.98 63.56,74.68 | 63.56,74.68 63.56,74.8 | 63.56,74.93 63.69,74.93 | 63.63,72.45 63.56,74.8 | 63.56,74.8 63.56,74.93 | 63.56,74.93 63.56,75.06 | 63.56,75.06 63.24,75.18 62.99,75.25 | 62.99,75.25 62.42,75.06 | 62.42,75.06 63.56,75.06 | 63.56,75.06 63.56,75.31 63.18,75.12 62.99,75.12 62.36,75.18 62.29,75.18 | 58.75,80.9 C65.2 | IC6.P13 23.96,95.14 24,95.19 | IC6.P24 23.98,87.99 24,88.01 | 54.74,40.89 54.67,40.89 53.34,39.56 C50.C 52.31,37.96 C51.2 | Q9.3 85.86,84.07 R76.2 83.14,82.38 83.12,82.36 83.12,82.17 82.1,81.15 78.8,81.15 v77.79,80.01 | 85.73,74.04 Q8.3 | SL1.7 37.46,3.56 37.46,9.08 37.91,9.53 C24.C 40.64,9.53 41.27,8.89 41.27,4.95 42.42,3.81 45.54,3.81 45.6,3.75 | U1.6 45.6,3.75 | 45.6,3.75 45.6,2.72 46.86,1.46 55.75,1.46 U1.GND1 | 23.94,11.87 23.94,15.11 24,15.18 24,11.94 23.94,11.87 | U1.CD2 49.91,14.35 v50.48,13.78 | R61.1 54.9,14.69 56.45,13.14 58.23,13.14 58.29,13.21 | 67.15,28.04 66.67,28.51 C45.C 63.06,28.95 61.4,30.61 | 67.15,28.04 68.64,26.54 68.64,24.32 68.77,24.19 | C53.2 73.01,24.36 C56.2 75.41,24.24 R50.1 | 72.96,26.8 72.96,27.81 72.45,28.32 67.44,28.32 67.18,28.07
  Top 0.406: 67.18,28.07 67.15,28.04 | v67.25,28.07 67.18,28.07 | 61.26,31.05 C59.2 61.4,30.62 61.4,31.75 61.72,32.07 61.78,32.07 61.91,32.19 63.12,32.19 63.55,32.62 C58.2 63.44,35.29 C48.C 63.24,37.66 63.24,38.42 62.72,39.07 C49.2 | C47.2 50.8,24.45 51.62,23.62 v51.62,22.8 52.07,22.8 53.15,21.72 53.15,21.08 53.08,21.02 53.15,20.95 | 77.66,80.01 77.66,80.07 77.6,80.14 77.6,80.39 78.42,81.22 81.79,81.22 82.8,82.23 82.8,83.38 83.12,83.69 83.12,84.33 83.56,84.77 84.96,84.77 85.15,84.58 85.15,84.84 85.22,84.9 86.99,84.9 87.31,84.58 87.31,84.14 | 86.74,84.14 87.31,84.14 | 87.31,84.14 87.31,83.44 87.12,83.25 86.29,83.25 | 86.29,83.95 86.29,83.25 | 86.29,83.25 85.22,83.25 85.09,83.38 85.09,83.82 83.5,83.82 | 83.5,83.82 83.5,82.68 | 83.5,83.82 83.5,84.33 83.56,84.39 84.77,84.39 84.77,83.44 84.9,83.31 83.5,83.31 83.37,83.19 83.37,82.8 83.5,82.68 | 83.5,82.68 83.5,82.23 82.29,81.03 78.93,81.03 77.79,79.88 v77.79,80.01 | v77.79,80.01 77.79,80.07 | 86.36,74.04 86.42,73.98 87.31,73.98 87.82,74.49 v87.82,75.12 | 86.68,74.17 87.18,74.17 87.44,74.42 87.44,75.12 87.63,75.31 87.82,75.31 87.95,75.18 88.01,75.18 88.14,75.06 88.14,74.49 87.5,73.85 86.68,73.85 86.61,73.91 | 29.53,97.41 29.53,98.61 27.37,100.78 24.64,100.78 | R43.2 33.15,96.71 34.16,97.73 v37.91,97.73 | C33.1 32.89,83.82 v32.32,83.25 | C5.1 83.4,11.2 82.93,10.73 82.93,10.48 82.99,10.41 82.99,9.34 82.93,9.27 85.6,9.27 85.79,9.08 85.79,3.11 85.72,3.05 76.83,3.05 76.64,3.24 76.64,8.95 76.71,9.02 76.71,3.24 76.64,3.17 85.6,3.17 85.72,3.3 87.37,3.3 89.79,5.71 93.85,5.71 94.93,4.64 94.93,3.62 JP26.2 | S3.2 98.66,30.8 98.66,29.16 99.5,28.32 101.6,28.32 JP21.2
  Top 0.406: 73.02,66.99 73.02,67.12 | 73.02,67.12 73.02,69.41 | 73.02,69.41 73.15,69.53 | 72.9,66.99 73.02,67.12 | 73.02,69.41 73.02,69.53 73.09,69.6 JP10.2 JP10.1 | JP10.1 73.09,74.68 73.15,74.74 73.15,74.68 JP10.1 | v64.9,73.85 64.64,73.66 63.56,73.66 | 87.37,42.1 87.88,42.1 88.45,42.67 89.6,42.67 89.72,43.31 Q7.S 91.82,44.7 S1.4 | 86.23,84.2 86.23,84.84 | v15.18,9.02 15.37,9.72 15.94,10.29 15.94,9.78 15.75,9.59 15.75,9.46 15.49,9.21 15.3,9.21 15.18,9.34 15.18,9.84 15.68,10.35 16.13,10.35 16.32,10.16 16.32,9.97 15.94,9.59 15.49,9.14 v15.18,9.02
  Top 0.61: IC10.1 61.15,79.26 LED1.C 58.74,79.22 | C40.2 15.28,85.83 v15.11,85.66 | 22.73,12 22.73,13.4 22.86,13.53 25.02,13.53 25.21,13.34 25.21,12.06 | C43.2 15.37,60.83 14.86,60.83 14.79,60.77 v14.48,60.77
  Top 1.27: 61.02,79.18 LED1.C | C61.C 89.02,100.33 89.09,100.39 | C65.2 58.74,79.22
  Top 1.422: 53.25,88.42 54.98,86.69 54.98,82.45 56.63,80.8 58.63,80.8
  Top 2.184: X11.2 58.77,98.47 J10.VIN0
  Top 2.54: IC2.EPAD 24,15.18 24,18.61 24,37.15 IC3.EPAD 24,44.26 24,56.39 24,62.93 IC5.EPAD 24,69.98 24,88.01 IC6.EPAD 24,95.19 24,99.19 24.95,100.14 24.95,100.6 C42.-
  Route2 0.254: v67.75,46.74 67.82,46.67 | v62.48,57.72 62.55,57.91 | v57.72,30.73 57.72,30.35 | v43.62,60.58 43.5,60.45
  Route2 0.305: v60.7,25.15 61.02,25.08 | v40.89,60.52 40.89,60.39
  Route2 0.406: v50.48,13.78 50.48,13.65 | v51.62,22.8 51.75,22.67 | v87.82,75.12 87.76,75.18 | v37.91,97.73 37.97,97.79 | v32.32,83.25 32.32,83.19
  Bottom 0.305: v33.65,9.21 33.65,8.26 33.27,7.87 33.27,5.97 31.56,4.25 31.56,2.86 SL1.5
  Bottom 0.406: v77.79,80.01 78.04,80.26 | v35.11,16.45 33.72,16.45 28.51,21.65 26.99,21.72 | JP10.1 73.09,75.37 72.33,76.14 66.8,76.14 64.77,74.11 v64.9,73.85
  other vias: 23.43,94.87 24.64,94.87 23.18,93.15 24.76,93.15 23.18,91.57 23.18,89.98 24.76,91.57 51.05,30.23 72.58,82.36 75.82,82.3 76.39,85.34 78.42,80.84 74.48,59.25 31.81,71.95 2.48,30.61 4.57,30.61 2.35,25.78 4.82,25.72 2.03,55.5 4.25,55.5 2.09,51.75 4.19,51.75 8.63,103.06 11.11,103 13.4,103 8.63,101.28 24.76,89.98 23.3,88.46 24.64,88.46 22.48,87 23.94,87 25.34,87 22.48,85.53 24,85.53 25.4,85.6 22.48,83.95 24.26,83.95 25.84,83.95 27.43,83.95 23.62,96.96 24.51,97.79 25.72,97.79 23.18,67.94 24.83,67.94 23.18,66.36 24.83,66.36 23.18,64.83 24.83,64.83 24.64,63.12 24.76,69.6 23.37,69.6 22.6,71.69 24.19,71.75 25.59,71.75 22.6,73.28 24.13,73.28 25.59,73.28 27.05,73.28 28.45,73.28 22.6,74.8 24.07,74.8 25.53,74.8 26.99,74.8 23.37,63.12 27.94,59.69 21.72,61.15 23.11,61.15 24.57,61.15 26.03,61.15 27.56,61.15 20.76,59.63 22.16,59.63 23.56,59.63 25.02,59.69 26.48,59.69 20.95,56.39 23.05,56.39 25.08,56.39 20.95,54.55 23.05,54.55 25.08,54.55 26.86,56.32 26.8,54.55 21.02,52.96 23.05,52.96 25.08,52.96 26.61,53.09 23.18,40.77 24.89,40.77 23.18,39.24 24.89,39.24 23.11,42.29 24.83,42.29 23.18,43.94 24.83,43.94 23.11,37.4 24.76,37.47 22.03,35.94 23.75,35.94 25.53,35.94 27.24,35.88 20.7,34.42 22.35,34.42 24,34.42 25.65,34.48 27.37,34.48 21.14,32.89 22.86,32.89 24.45,32.89 26.16,32.96 27.81,32.89 29.46,32.89 20.83,29.84 22.67,29.84 24.45,29.84 26.22,29.84 28.07,29.84 29.91,29.84 20.89,28.26 22.67,28.32 24.45,28.32 26.22,28.32 28.07,28.32 20.83,26.8 22.67,26.86 24.38,26.8 26.22,26.73 23.18,15.11 24.83,15.11 23.18,13.65 24.83,13.65 23.05,11.87 24.83,11.94 22.16,10.48 23.56,10.48 25.02,10.48 26.35,9.91 22.16,9.14 23.56,9.14 23.18,16.64 24.83,16.64 23.11,18.35 24.89,18.35 21.21,20.26 22.67,20.26 24.13,20.26 25.59,20.26 26.99,20.26 21.21,21.65 22.6,21.65 24.07,21.72 25.59,21.72 22.6,23.05 24,23.05 25.34,23.05 22.67,45.85 24.19,45.85 25.72,45.85 22.67,47.43 24.13,47.43 25.59,47.43 22.67,49.02 24.13,49.02 25.46,49.02 8.13,4.57 8.13,3.05 16.06,4.64 17.84,4.64 19.49,4.64 16.13,2.92 17.84,2.98 19.43,2.98 10.98,2.16 13.91,2.16
  pour Route2: -3.68,107.63 108.65,107.63 109.03,107.25 109.03,-2.86 109.09,-2.92 -3.3,-2.92 -3.62,-2.6 -3.62,106.43 -4,106.81 -4,107.38 -3.75,107.63
  pour Top: 14.86,74.74 8.83,74.74 7.49,76.07 7.17,76.39 7.17,79.95 8.95,81.72 10.1,81.72 10.86,82.49 14.16,82.49 14.48,82.17 18.03,82.17 19.94,84.07 21.65,85.79 21.65,87.44 22.16,87.95 25.21,87.95 26.03,87.12 26.03,86.49 28.45,84.07 28.45,75.63 30.35,73.72 37.65,73.72 38.42,72.96 38.42,72.64 37.21,71.44 26.73,71.44 25.53,70.23 23.3,70.23 23.05,69.98 20.95,69.98 20.57,70.36 20.57,71.31 17.21,74.68 17.14,74.74
  pour Top: 15.18,5.4 7.68,5.4 6.16,3.87 6.16,1.08 6.92,0.32 22.03,0.32 22.67,0.95 22.67,7.43 24.51,9.27 25.34,9.27 25.84,9.78 25.84,10.79 25.53,11.11 25.53,13.65 25.08,14.1 23.18,14.1 22.6,13.53 22.6,11.94 22.22,11.56 21.46,11.56 21.27,11.37 21.27,9.72 19.05,7.49 17.4,5.84 17.02,5.46 16.95,5.4
  pour Top: 72.2,86.36 76.71,86.36 77.79,85.28 77.79,83.31 75.82,81.34 72.01,81.34 71.25,82.11 71.25,85.41
  pour Top: 72.71,57.47 73.47,57.47 74.61,56.32 75.18,55.75 80.71,55.75 81.34,56.39 81.34,58.99 80.01,60.33 79.69,60.33 79.18,59.82 72.2,59.82 71.44,59.05 71.44,58.67 72.71,57.4
  pour Top: 5.52,24.83 1.84,24.83 1.14,25.53 1.14,31.31 1.78,31.94 5.52,31.94 6.16,31.31 6.16,25.4 5.59,24.83
  pour Top: 4.51,50.8 1.46,50.8 0.82,51.44 0.82,56.2 1.46,56.83 5.33,56.83 5.59,56.58 5.59,51.88
  pour Top: 14.73,49.15 1.78,49.15 1.14,49.78 1.14,52.2 1.4,52.45 5.27,52.45 6.67,51.05 6.79,50.93 11.24,50.93 12.32,52.01 12.44,52.13 12.44,55.44 11.24,56.64 11.17,56.71 7.3,56.71 5.46,54.86 1.52,54.86 0.89,55.5 0.89,57.21 1.52,57.85 1.65,57.98 17.84,57.98 19.62,59.75 19.75,59.88 19.75,61.85 20.51,62.61 25.59,62.61 26.16,62.04 28.13,62.04 28.76,61.4 28.89,61.28 28.89,59.82 29.53,59.18 29.84,58.86 29.97,58.74 35.5,58.74 36.32,57.91 36.32,54.93 34.35,52.96 31.43,52.96 28.83,50.36 27.62,49.15 27.62,46.29 26.48,45.15 25.97,45.15 25.65,44.83 25.59,44.77 25.59,36.7 25.91,36.39 27.88,36.39 28.19,36.07 28.19,35.69 28.95,34.92 28.95,34.67 29.34,34.29 33.59,34.29 34.03,33.85 34.03,32.32 29.65,27.94 29.65,25.72 29.08,25.15 28.95,25.02 28.95,22.48 28,21.53 27.88,21.4 27.88,19.81 27.49,19.43 25.91,19.43 25.59,19.11 25.59,11.11 25.91,10.79 27.94,10.79 28.38,10.35 28.38,9.46 27.68,8.76 23.56,8.76 22.16,10.16 22.16,11.43 22.35,11.62 22.35,18.48 22.1,18.73 20.57,18.73 20.38,18.92 20.38,20.26 16.45,24.19 2.09,24.19 1.4,24.89 1.4,31.69 1.97,32.26 11.11,32.26 11.3,32.45 17.27,32.45 20,35.18 20,36.32 20.76,37.08 22.1,37.08 22.29,37.27 22.54,37.53 22.54,43.94 22.03,44.45 21.21,44.45 20.83,44.83 20.83,45.21 17.02,49.02 16.89,49.15
  pour Top: 14.22,99.95 11.75,99.95 11.11,100.58 8.06,100.58 6.73,101.92 6.73,103.25 7.43,103.95 13.97,103.95 14.86,103.06 15.24,102.68 15.24,100.9 14.35,100.01 14.16,100.01
  pour Bottom: 23.56,98.42 28.19,98.42 28.51,97.85 28.51,87.12 32.57,83.31 32.57,76.64 37.78,71.44 37.78,10.92 32.96,6.1 22.6,6.1 19.87,8.83 19.87,91.76 23.49,98.36 23.49,98.49
  pour Top: 22.73,97.85 22.73,103.44 23.24,103.95 41.53,103.95 43.05,102.43 43.05,100.27 42.54,99.76 32.57,99.76 29.78,96.96 23.56,96.96 22.73,97.79
  pour Bottom: 15.56,8.83 19.11,5.27 21.53,5.27 22.67,4.13 22.67,0.95 22.03,0.32 7.81,0.32 6.16,1.97 6.16,7.3 8.51,9.65 10.6,9.65 11.11,10.16 11.11,20.26 10.29,21.08 8.32,21.08 7.05,22.35 2.6,22.35 0.57,24.38 0.57,32.07 1.59,33.08 7.11,33.08 8.06,34.04 8.06,35.31 8.32,35.56 10.41,35.56 11.05,36.2 11.05,46.04 10.41,46.67 8.51,46.67 7.11,48.07 2.09,48.07 0.76,49.4 0.76,57.72 1.71,58.67 7.49,58.67 8,59.18 8,60.45 8.7,61.15 10.1,61.15 10.67,61.72 10.67,73.09 11.75,74.17 13.21,74.17 14.6,72.77 14.6,62.42 14.92,62.1 14.92,60.45 14.54,60.07 14.54,57.09 13.97,56.52 7.43,56.52 5.84,54.93 5.84,52.39 7.05,51.18 14.1,51.18 14.79,50.48 14.79,36.45 15.37,35.88 15.37,31.75 14.92,31.31 7.81,31.31 6.35,29.84 6.35,26.35 7.36,25.34 14.79,25.34 15.56,24.57
  pour Bottom: 5.78,99.38 5.78,103.76 6.79,104.78 16.95,104.78 17.84,103.89 16.25,102.3 14.79,100.84 14.54,100.58 14.48,100.52 14.48,87.5 15.37,86.61 15.37,85.22 13.27,83.12 8.38,83.12 7.43,84.07 7.43,85.28 8.38,86.23 9.71,86.23 10.48,87 10.48,96.58 9.71,97.35 7.81,97.35 5.84,99.31
GPIO_FET
  Top 0.305: Q7.G 90.3,50.67 90.3,52.2 89.66,52.83 88.26,52.83 87.72,52.28 R70.2
ISP_BOOT  (via drill 0.6)
  Top 0.254: S2.2 v80.45,38.29 | IC1.53 58,61.7 58.67,61.02 59.69,61.02 v59.88,61.21
  Top 0.406: JP25.2 89.19,40.6 R15.1 88.07,38.23 87.76,38.23 S2.1 S2.2
  Route15 0.254: v80.45,38.29 80.45,39.69 78.87,41.27 78.87,51.44 78.55,51.75 78.55,53.66 78.1,54.1 74.04,54.1 69.85,58.29 66.55,58.29 66.17,58.67 66.17,60.45 65.4,61.21 v59.88,61.21
LED1
  Top 0.254: IC1.32 72.45,60.96 72.45,62.42 67.18,67.69 66.17,67.69 65.85,68.01 61.47,68.01 58.93,70.55 JP29.1 58.93,73.44 R10.2
LED1/REGOFF  (via drill 0.6)
  Top 0.254: IC8.3 54.8,29.98 v54.86,29.97
  Route2 0.254: v54.86,29.97 54.86,27.18 55.31,26.73 55.31,22.99 57.34,20.95 57.34,16.32 55.88,14.86 55.88,7.87 58.42,5.33 RJ1.G+
LED2
  Top 0.254: IC1.33 67.21,56.42 71.94,61.15 71.94,62.17 66.99,67.12 65.85,67.12 65.53,67.44 61.21,67.44 60.32,68.33 59.43,68.33 56.45,71.31 56.45,72.33 JP29.2 56.39,74.02 R11.2
LED2/NINTSEL  (via drill 0.6)
  Top 0.254: IC8.2 53.83,29.48 54.74,28.57 56.01,28.57 56.26,28.83 56.25,29.48 | 56.25,29.48 56.32,29.4 | 56.32,30.42 v56.32,30.73 56.25,30.66 56.25,29.48 | 56.25,29.48 56.29,29.48 R62.2
  Route2 0.254: RJ1.Y+ 73.02,6.29 72.39,6.92 66.61,6.92 64.64,8.89 64.64,11.94 62.55,14.03 61.4,14.03 60.01,15.43 59.94,15.43 58.04,17.34 58.04,21.4 56.07,23.37 56.07,27.11 55.62,27.56 55.62,29.4 56.32,30.1 v56.32,30.73
LED3
  Top 0.254: IC1.34 66.87,56.77 71.25,61.15 71.25,62.1 66.8,66.55 65.59,66.55 65.28,66.86 60.96,66.86 60.07,67.75 59.18,67.75 58.29,68.64 57.28,68.64 56.77,69.15 56.7,69.15 54.23,71.63 54.23,72.01 JP29.3 53.85,73.38 R12.2
LED4
  Top 0.254: IC1.35 66.48,57.15 70.55,61.21 70.55,62.04 66.61,65.98 65.34,65.98 65.02,66.29 60.7,66.29 59.82,67.18 58.93,67.18 57.97,68.14 56.77,68.14 56.13,68.77 55.24,68.77 52.01,72.01 51.69,72.01 JP29.4 51.31,72.81 R13.2
MISO1
  Top 0.254: IC1.61 55.15,58.89 53.4,60.64 53.4,61.02 54.61,62.23 54.61,62.93 54.99,63.31 54.99,64.52 53.78,65.72 JP3.1
MOSFET_DRIVE
  Top 0.254: 100.01,66.86 99.66,66.86 X5.1 | 97.78,77.03 J9.2 | 93.22,55.82 93.79,55.88 93.22,55.69 | 83.25,55.94 83.18,55.94 83.18,55.75
  Top 0.305: R68.1 82.4,44.73 81.79,45.34 81.79,49.53 80.26,51.05 80.26,53.15 83.25,56.13 | 83.06,55.94 83.06,55.88 83.18,55.75
  Top 0.406: R67.1 83.82,62.87 84.52,62.17 84.52,57.55 C60.+
  Top 1.27: X10.2 98.39,76.29 97.59,77.09 97.59,76.65 96.13,73.98 96.01,70.87 95.82,70.67 | 95.82,70.67 95.82,70.36 99.44,66.74 99.44,68.01 97.03,70.42 97.26,74.64 98.02,75.41 102.42,75.57 102.48,75.63 102.48,75.82 103.18,76.52 102.93,76.52 102.23,77.22 97.34,77.22 95.11,73.61 95.5,73.91 95.12,73.53 95.12,71.63 95.31,71.44 95.5,69.53 97.79,67.25 100.01,66.86 100.14,66.74 100.14,67.06 97.53,69.66 97.53,72.14 99.12,75.25 102.1,75.25 102.61,75.76 102.1,75.76 101.66,76.2 98.61,76.2 97.78,77.03 | 95.82,70.67 95.55,70.67 J5.P$4 | 84.01,57.09 84.01,55.88 85.22,54.67 93.66,54.67 96.58,51.56 95.76,51.56 96.45,50.99 | 96.45,50.99 103.19,50.99 103.5,51.24 103.5,52.39 103.06,52.83 | 103.06,52.83 102.93,52.96 | 102.93,52.96 100.71,52.96 100.2,52.45 97.66,52.45 97.09,53.02 | 97.09,53.02 98.11,53.02 | 98.11,53.02 102.87,53.02 102.93,52.96 | 103.06,52.83 98.3,52.83 98.11,53.02 | 97.09,53.02 93.22,55.82 92.71,55.88 86.74,55.88 85.91,56.71 85.91,58.04 85.53,58.42 83.75,58.42 83.25,57.91 83.25,56.13 83.25,55.94 84.83,54.55 93.15,54.55 95.95,51.44 96.2,50.99 96.45,50.99